# Altium project MC21R01.PrjPCB (part 1 of 3)
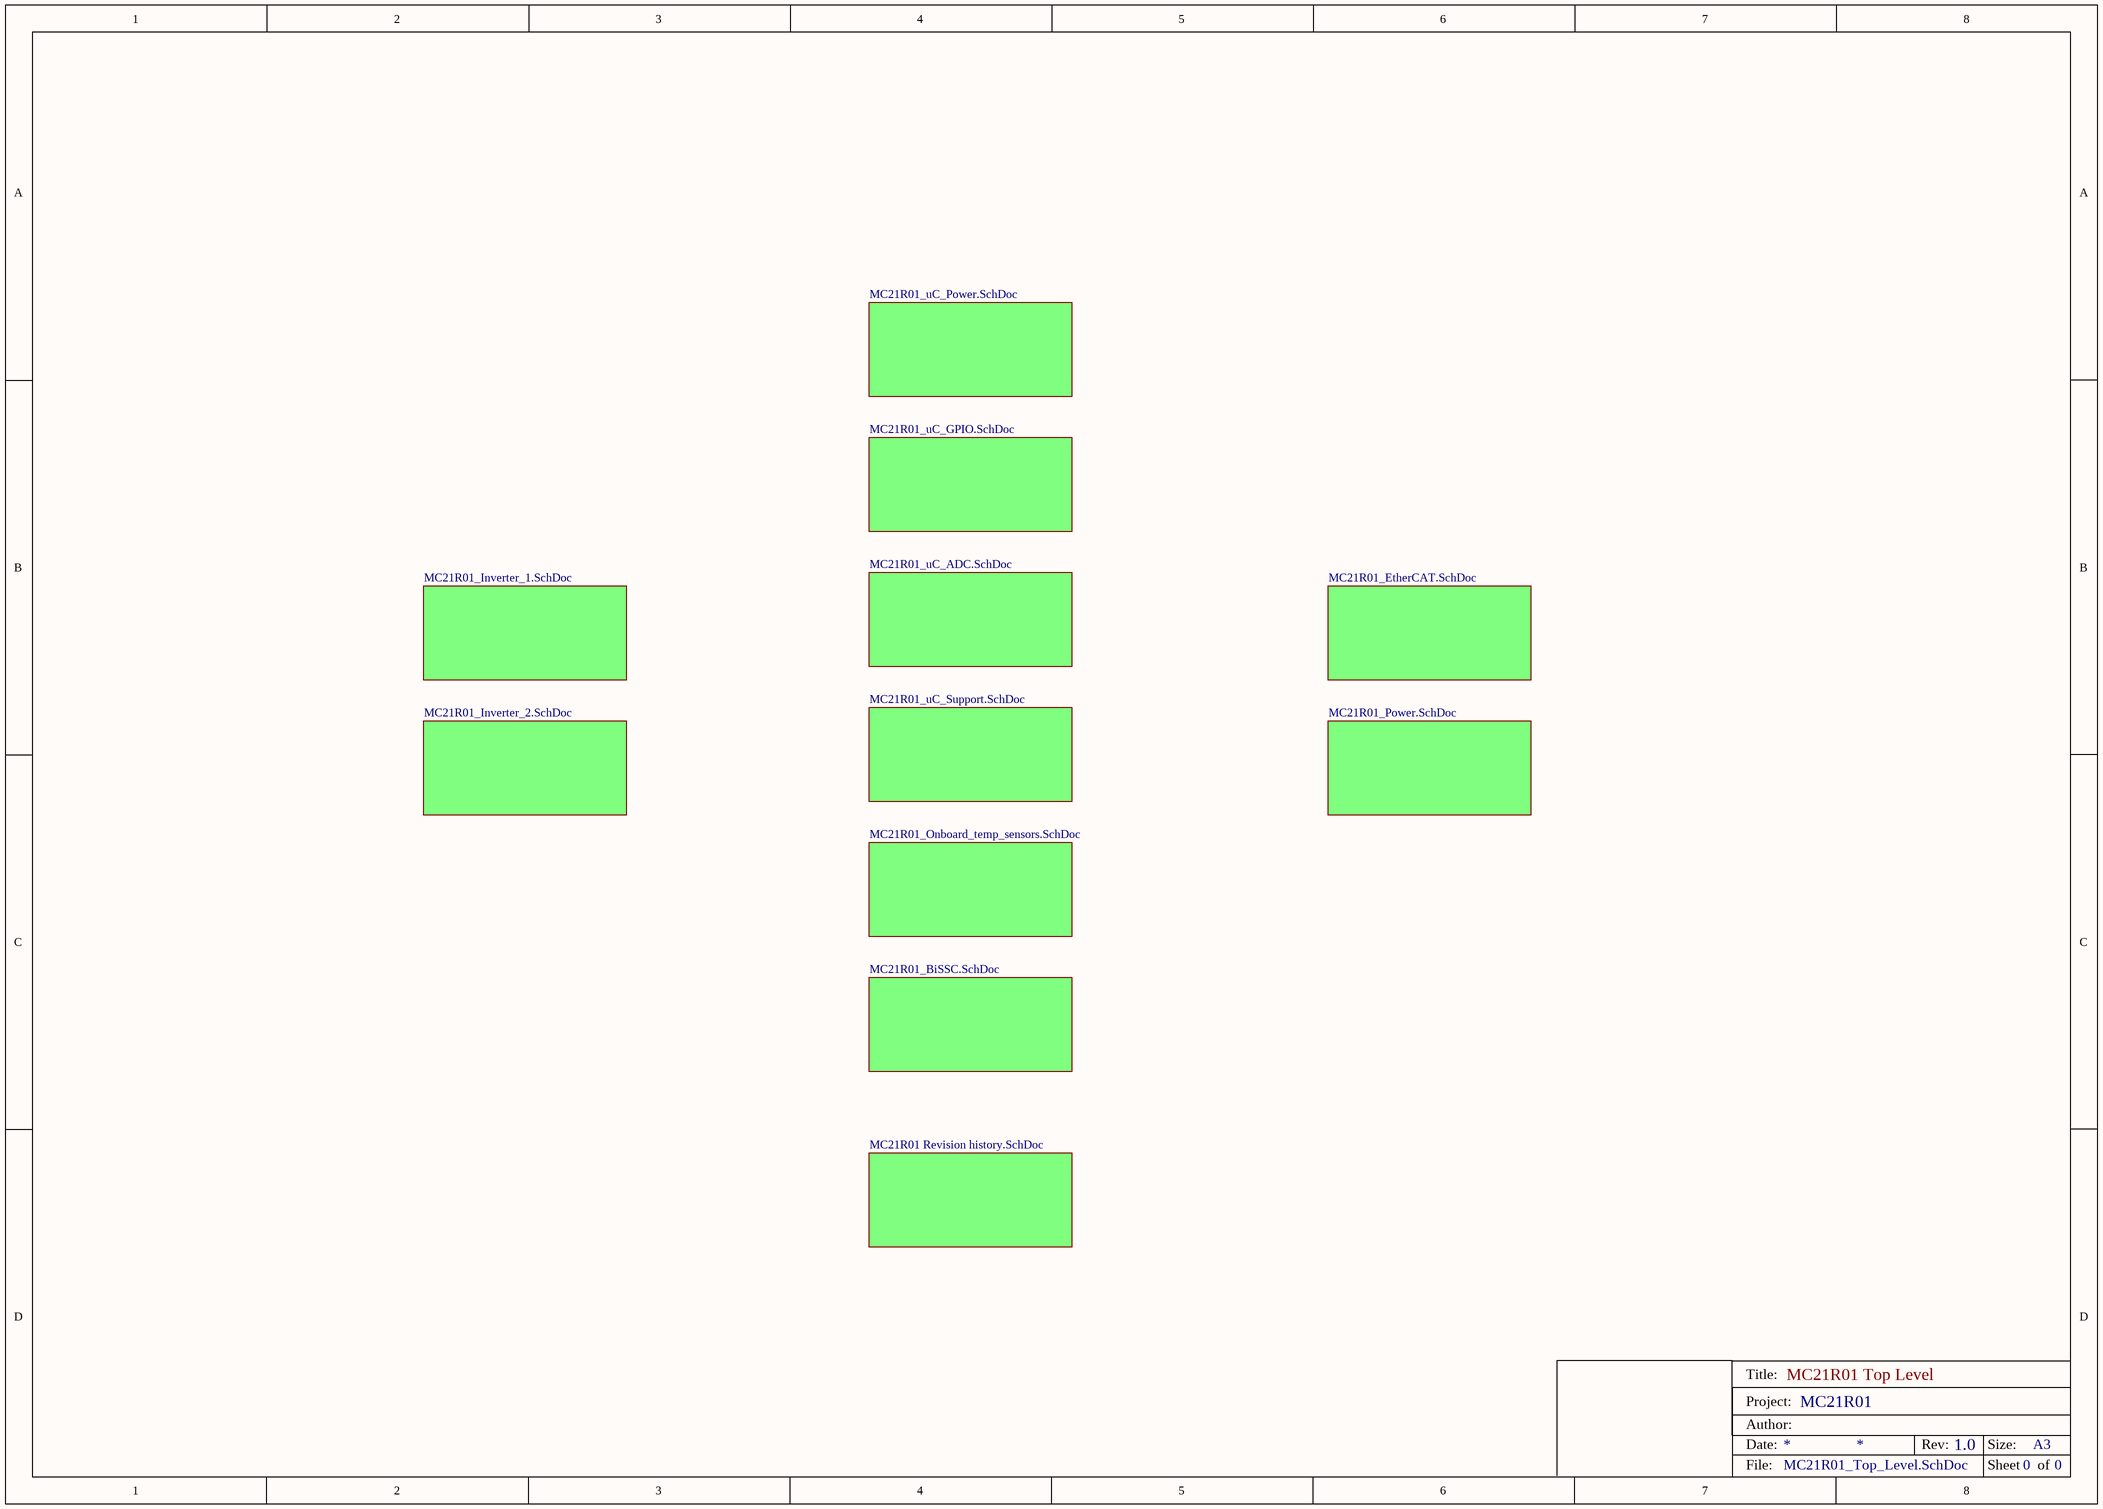
[diagram p0: MC21R01_Top_Level.SchDoc]
Company: PAL Robotics; Projectrevision: 1.00; ProjectTitle: MC21R01
11 sheets, 452 parts. Net scope: global (net labels, ports and power ports of the same name join across sheets).
Board file: MC21R01.PcbDoc
Sheets:
  MC21R01_Top_Level.SchDoc
     = MC21R01_uC_Support.SchDoc
     = MC21R01_uC_Power.SchDoc
     = MC21R01_uC_GPIO.SchDoc
     = MC21R01_Inverter_1.SchDoc
     = MC21R01_Inverter_2.SchDoc
     = MC21R01_Onboard_temp_sensors.SchDoc
     = MC21R01_uC_ADC.SchDoc
     = MC21R01_EtherCAT.SchDoc
     = MC21R01_BiSSC.SchDoc
     = MC21R01_Power.SchDoc

## Sheet MC21R01_Top_Level.SchDoc: MC21R01 Top Level
size A3; Author: AMP; DrawnBy: AMP; Organization: Altium Limited; Address1: 3 Minna Close; Address2: Belrose; Address3: NSW 2085; Address4: Australia; DocumentNumber: 0; Revision: 1.0; SheetNumber: 0; SheetTotal: 0

### Sub-sheets
? = MC21R01 Revision history.SchDoc (file not in this document): no entries
? = MC21R01_uC_Support.SchDoc: no entries
? = MC21R01_uC_Power.SchDoc: no entries
? = MC21R01_uC_GPIO.SchDoc: no entries
? = MC21R01_Inverter_1.SchDoc: no entries
? = MC21R01_Inverter_2.SchDoc: no entries
? = MC21R01_Onboard_temp_sensors.SchDoc: no entries
? = MC21R01_uC_ADC.SchDoc: no entries
? = MC21R01_EtherCAT.SchDoc: no entries
? = MC21R01_BiSSC.SchDoc: no entries
? = MC21R01_Power.SchDoc: no entries

### Notes on the sheet
- Title:
- Date:
- Project:
- Author:
- Rev:
- Size:
- A3
- File:
- Sheet
- of

## Sheet MC21R01_uC_Support.SchDoc: MC21R01 Top Level
size A3; Author: AMP; DrawnBy: AMP; Organization: Altium Limited; Address1: 3 Minna Close; Address2: Belrose; Address3: NSW 2085; Address4: Australia; DocumentNumber: 0; Revision: 1.0; SheetNumber: 0; SheetTotal: 0
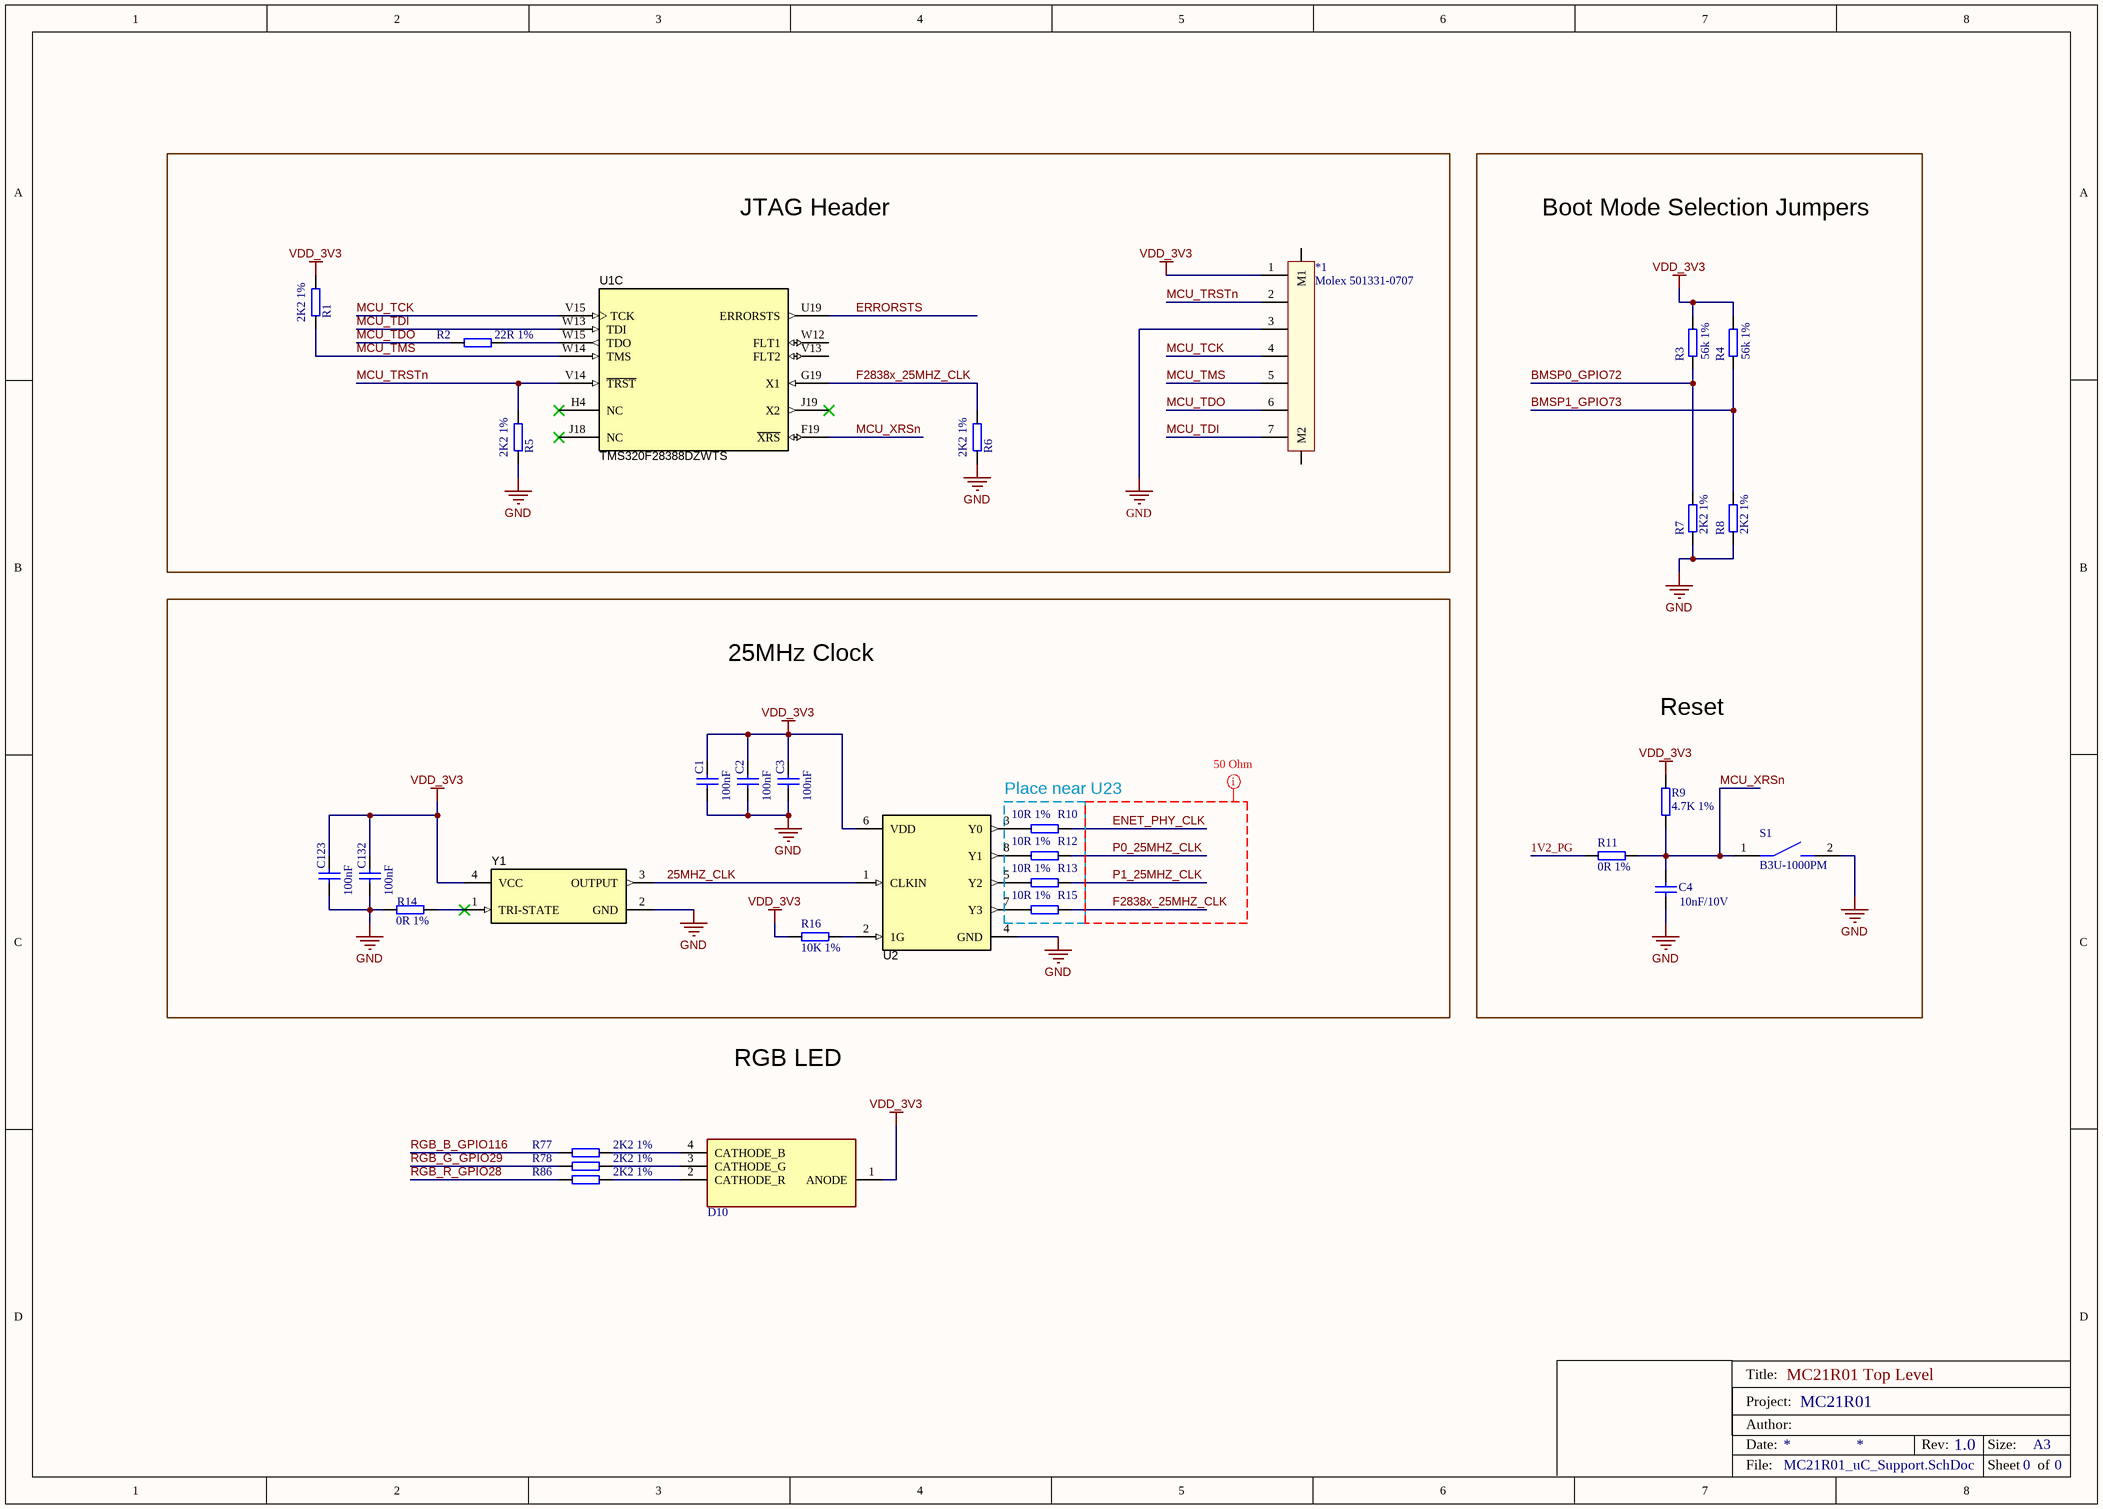
[diagram p1: MC21R01_uC_Support.SchDoc]

### Parts
*1  Molex 501331-0707  [Molex 501331-0707]
C1  value 100nF  [CAPC0603X03N]  (hidden comment: 100nF/25V 0201 10% X6S)
C2  value 100nF  [CAPC0603X03N]  (hidden comment: 100nF/25V 0201 10% X6S)
C3  value 100nF  [CAPC0603X03N]  (hidden comment: 100nF/25V 0201 10% X6S)
C4  value 10nF/10V  [0402 SMD Capacitor]  (hidden comment: 10nF/10V 0402 20% X5R)
C123  value 100nF  [CAPC0603X03N]  (hidden comment: 100nF/25V 0201 10% X6S)
C132  value 100nF  [CAPC0603X03N]  (hidden comment: 100nF/25V 0201 10% X6S)
D10  RGB LED  [LRTB R48G]  (value not drawn)
R1  2K2 1%  [0402 SMD rESISTOR]
R2  22R 1%  [0402 SMD rESISTOR]
R3  56k 1%  [0402 SMD rESISTOR]
R4  56k 1%  [0402 SMD rESISTOR]
R5  2K2 1%  [0402 SMD rESISTOR]
R6  2K2 1%  [0402 SMD rESISTOR]
R7  2K2 1%  [0402 SMD rESISTOR]
R8  2K2 1%  [0402 SMD rESISTOR]
R9  4.7K 1%  [0402 SMD rESISTOR]
R10  10R 1%  [0402 SMD rESISTOR]
R11  0R 1%  [0402 SMD rESISTOR]
R12  10R 1%  [0402 SMD rESISTOR]
R13  10R 1%  [0402 SMD rESISTOR]
R14  0R 1%  [0402 SMD rESISTOR]
R15  10R 1%  [0402 SMD rESISTOR]
R16  10K 1%  [0402 SMD rESISTOR]
R77  2K2 1%  [0402 SMD rESISTOR]
R78  2K2 1%  [0402 SMD rESISTOR]
R86  2K2 1%  [0402 SMD rESISTOR]
S1  B3U-1000PM  [B3U1000PM]
U1  PartNumber: TMS320F28388DZWTS  [ZWT0337A]  (hidden comment: CMP-008-0011-AA01)  (part C of 5)
U2  LMK1C1104PWR  [SOP65P640X120-8N]  (value not drawn)
Y1  ECS-2520S33-250-FN-TR  [ECS_ECS-2520S]  (value not drawn)

### Blocks framed on the sheet
JTAG Header: *1 R1 R2 R5 R6 U1
25MHz Clock: C1-C3 C123 C132 R10 R12-R16 U2 Y1

### Nets
GND: *1.3 C1.1 C2.1 C3.1 C4.2 C123.1 C132.1 R5.1 R6.1 R7.1 R8.1 R14.2 S1.2(NO) U2.4(GND) Y1.2(GND)
VDD_3V3: *1.1 C1.2 C2.2 C3.2 C123.2 C132.2 D10.1(ANODE) R1.2 R3.2 R4.2 R9.2 R16.2 U2.6(VDD) Y1.4(VCC)
1V2_PG: R11.2
25MHZ_CLK: U2.1(CLKIN) Y1.3(OUTPUT)
BMSP0_GPIO72: R3.1 R7.2
BMSP1_GPIO73: R4.1 R8.2
ENET_PHY_CLK: R10.1
ERRORSTS: U1.U19(ERRORSTS)
F2838x_25MHZ_CLK: R6.2 R15.1 U1.G19(X1)
MCU_TCK: *1.4 U1.V15(TCK)
MCU_TDI: *1.7 U1.W13(TDI)
MCU_TDO: *1.6 R2.2
MCU_TMS: *1.5 R1.1 U1.W14(TMS)
MCU_TRSTn: *1.2 R5.2 U1.V14(~{TRST})
MCU_XRSn: C4.1 R9.1 R11.1 S1.1(COM) U1.F19(~{XRS})
P0_25MHZ_CLK: R12.1
P1_25MHZ_CLK: R13.1
RGB_B_GPIO116: R77.2
RGB_G_GPIO29: R78.2
RGB_R_GPIO28: R86.2
NetD10_2: D10.2(CATHODE_R) R86.1
NetD10_3: D10.3(CATHODE_G) R78.1
NetD10_4: D10.4(CATHODE_B) R77.1
NetR2_1: R2.1 U1.W15(TDO)
NetR10_2: R10.2 U2.3(Y0)
NetR12_2: R12.2 U2.8(Y1)
NetR13_2: R13.2 U2.5(Y2)
NetR14_1: R14.1 Y1.1(TRI-STATE)
NetR15_2: R15.2 U2.7(Y3)
NetR16_1: R16.1 U2.2(1G)

Not connected (* = marked no-connect by the designer): *1 M1 M2; U1 H4(NC)* J18(NC)* J19(X2)* V13(FLT2) W12(FLT1)

### Layout directives
50 Ohm Impedance: Undefined: ENET_PHY_CLK, F2838x_25MHZ_CLK, P0_25MHZ_CLK, P1_25MHZ_CLK

### Notes on the sheet
- Boot Mode Selection Jumpers
- Reset
- Place near U23
- RGB LED
- Title:
- Date:
- Project:
- Author:
- Rev:
- Size:
- A3
- File:
- Sheet
- of

### Library data of the parts
*1 = Molex 501331-0707: PicoClasp 07 pin vertical; Supplier 1: Digi-Key; Supplier Part Number 1: WM7884TR-ND
C1-C3 C123 C132 = CMP-001-00061-1: 100nF/25V 0201 10% Tolerance X6S Multilayer Ceramic Chip Capacitor; Populated: Yes; Provided by customer: No; Voltage Rating (DC): 25V; Capacitance: 100nF; Case/Package: 0201; Case Code (Imperial): 0201; Case Code (Metric): 0603; Dielectric: X6S; Height: 0.3mm; Length: 0.024inch; Max Operating Temperature: 105°C; Min Operating Temperature: -55°C; Mount: Surface Mount; Package Quantity: 15000; Packaging: Tape and Reel; Termination: SMD/SMT; Thickness: 0.013inch; Tolerance: 10%; Voltage Rating: 25V; Weight: 1.2E-05oz; Width: 0.3mm
C4 = 10nF/10V 0402 20% X5R: 10nF/10V 0402 20% Tolerance X5R Multilayer Ceramic Chip Capacitor; Manufacturer 1: KEMET; Manufacturer Part Number 1: C0402C103K8PACTU; Supplier Part Number 1: 2773069; Supplier 1: Farnell
D10 = LRTB_R48G: RGB LED, SMD 1x1mm common anode; Manufacturer: OSRAM; Datasheet Link: https://dammedia.osram.info/media/resource/hires/osram-dam-4307982/LRTB%20R48G.pdf; Height: 0.65mm; Manufacturer Part Number: LRTB R48G; Supplier 1: Farnell; Supplier Part Number 1: 2981676; Created by: AMP; Published: 24-08-2020
R1 R5-R8 R77 R78 R86 = 2K2/50V 1% 0402 100mW: 2K2/50V 1% 0402 100mW SMD Resistor; Manufacturer 1: Yageo; Manufacturer Part Number 1: RC0402FR-072K2L; Value: 2.2k; Supplier 1: Farnell; Supplier Part Number 1: 9239278
R2 = 22R/50V 1% 0402 63mW: 22R/50V 1% 0402 63mW SMD Resistor; Manufacturer 1: Vishay; Manufacturer Part Number 1: CRCW040222R0FKED; Supplier 1: Farnell; Supplier Part Number 1: 1469697; Value: 22R
R3 R4 = 56k/50V 1% 0402 100mW: 56k/50V 1% 0402 63mW SMD Resistor; Manufacturer 1: Yageo; Manufacturer Part Number 1: RC0402FR-0756KL; Supplier 1: Farnell; Supplier Part Number 1: 9239448; Value: 56k
R9 = 4.7K/50V 1% 0402 100mW: 4.7K/50V 1% 0402 100mW SMD Resistor; Manufacturer 1: Vishay; Manufacturer Part Number 1: CRCW04024K70FKED; Supplier 1: Farnell; Supplier Part Number 1: 1469712; Value: 4.7K
R10 R12 R13 R15 = 10R/50V 1% 0402 63mW: 10R/50V 1% 0402 63mW SMD Resistor; Manufacturer 1: Yageo; Manufacturer Part Number 1: RC0402FR-0710RL; Supplier 1: Farnell; Supplier Part Number 1: 9238999; Value: 10R
R11 R14 = 0R/50V 1% 0402 100mW: 0R/50V 1% 0402 100mW SMD Resistor; Manufacturer 1: Vishay; Manufacturer Part Number 1: CRCW04020000Z0ED; Supplier 1: Farnell; Supplier Part Number 1: 1469661; Value: 0R
R16 = 10K/50V 1% 0402 100mW: 10K/50V 1% 0402 100mW SMD Resistor; Manufacturer 1: Yageo; Manufacturer Part Number 1: RC0402FR-0710KL; Supplier 1: Farnell; Supplier Part Number 1: 9239359; Value: 10K
S1 = B3U-1000PM: Tactile switch, top actuator; Manufacturer: Omron Electronics; Datasheet Link: https://componentsearchengine.com/Datasheets/1/B3U-1000PM.pdf; Height: 1.75mm; Manufacturer Part Number: B3U-1000PM; Arrow Part Number: B3U-1000PM; Supplier 1: Mouser; Supplier Part Number 1: 653-B3U-1000PM; Mouser Price/Stock: https://www.mouser.co.uk/ProductDetail/Omron-Electronics/B3U-1000PM?qs=hnUcNC2tU0oiJUWqjOlHqA%3D%3D; Created by: AMP; Published: 26-08-2020
U1 = CMP-008-0011-AA01: TMS320F28388DZWTS, ZWT0337A (NFBGA-337); Manufacturer: Texas Instruments; SizeAreaWB_mm2: 324; SizeArea_mm2: 256; AEC Qualified: N; AEC Category: Q200; SizeZ_mm: 1.4; SizeY_mm: 16; CompType: IC; ComponentLink1Description: Datasheet Link; ComponentLink2Description: Product Folder; PackageReference: ZWT0337A; PackageDescription: NFBGA-337; ComponentLink2URL: http://www.ti.com/product/tms320f28388d; Alternate Manufacturer: Texas Instruments; ComponentLink3URL: http://www.ti.com/product/tms320f28388d/datasheet; ComponentLink1URL: http://www.ti.com/lit/ds/symlink/tms320f28388d.pdf; MountType: SMT; ComponentLink3Description: Online Datasheet; SizeX_mm: 16; Design Item ID: TMS320F28388; Source: MC21R01.SCHLIB; Pin Count: 337; Component Type: Standard
U2 = LMK1C1104PWR: Low Jitter, 1:4 LVCMOS Fan-out Clock Buffer, PW0008A (TSSOP-8); Alternate Manufacturer: Texas Instruments; Green_Lifecycle: Active; SizeAreaWB_mm2: 42.0; Green_REACh: Passed; U/M: EA; SizeZ_mm: 1.2; SizeX_mm: 6.4; SizeY_mm: 3.0; SizeArea_mm2: 19.2; CompType: IC; ComponentLink1URL: http://www.ti.com/lit/ds/symlink/cdclvc1104.pdf; Publisher: Texas Instruments; PackageDescription: TSSOP-8; RoHS: Y; MountType: SMT; Green_EU RoHS-2: Passed; Manufacturer: Texas Instruments; Green_EU RoHS: Passed; PackageReference: PW0008A; PartNumber: LMK1C1104PWR; ComponentLink1Description: Datasheet Link; Supplier 1: Mouser; Supplier Part Number 1: 595-LMK1C1104PWR
Y1 = CMP-0082061-1: Oscillator, 25 MHz, 15 pF, SMD; Manufacturer: ECS Inc.; Frequency Stability: 10 ppm; SizeAreaWB_mm2: 10.5; SizeArea_mm2: 5; AEC Qualified: N; AEC Category: Q200; TaMax_C: 85°C; SizeZ_mm: 1; Frequency_Fixed: 25MHz; TaMin_C: -40°C; SizeY_mm: 2.5; Load Capacitance: 15 pF; SizeX_mm: 2; ComponentLink1Description: Datasheet Link; RoHS: Y; Supplier 1: Digi-Key; PackageReference: 2x2.5mm; PartNumber: ECS-2520S33-250-FN-TR; Supplier Part Number 2: 520-2520S33-250-FNT; Supplier 2: Mouser; AEC Grade: N/A; ComponentLink1URL: https://www.ecsxtal.com/store/pdf/ECS-2520S.pdf; CompType: Oscillator; Supplier Part Number 1: XC2198CT-ND; MountType: SMT

## Sheet MC21R01_uC_Power.SchDoc: MC21R01 Top Level
size A3; Author: AMP; DrawnBy: AMP; Organization: Altium Limited; Address1: 3 Minna Close; Address2: Belrose; Address3: NSW 2085; Address4: Australia; DocumentNumber: 0; Revision: 1.0; SheetNumber: 0; SheetTotal: 0
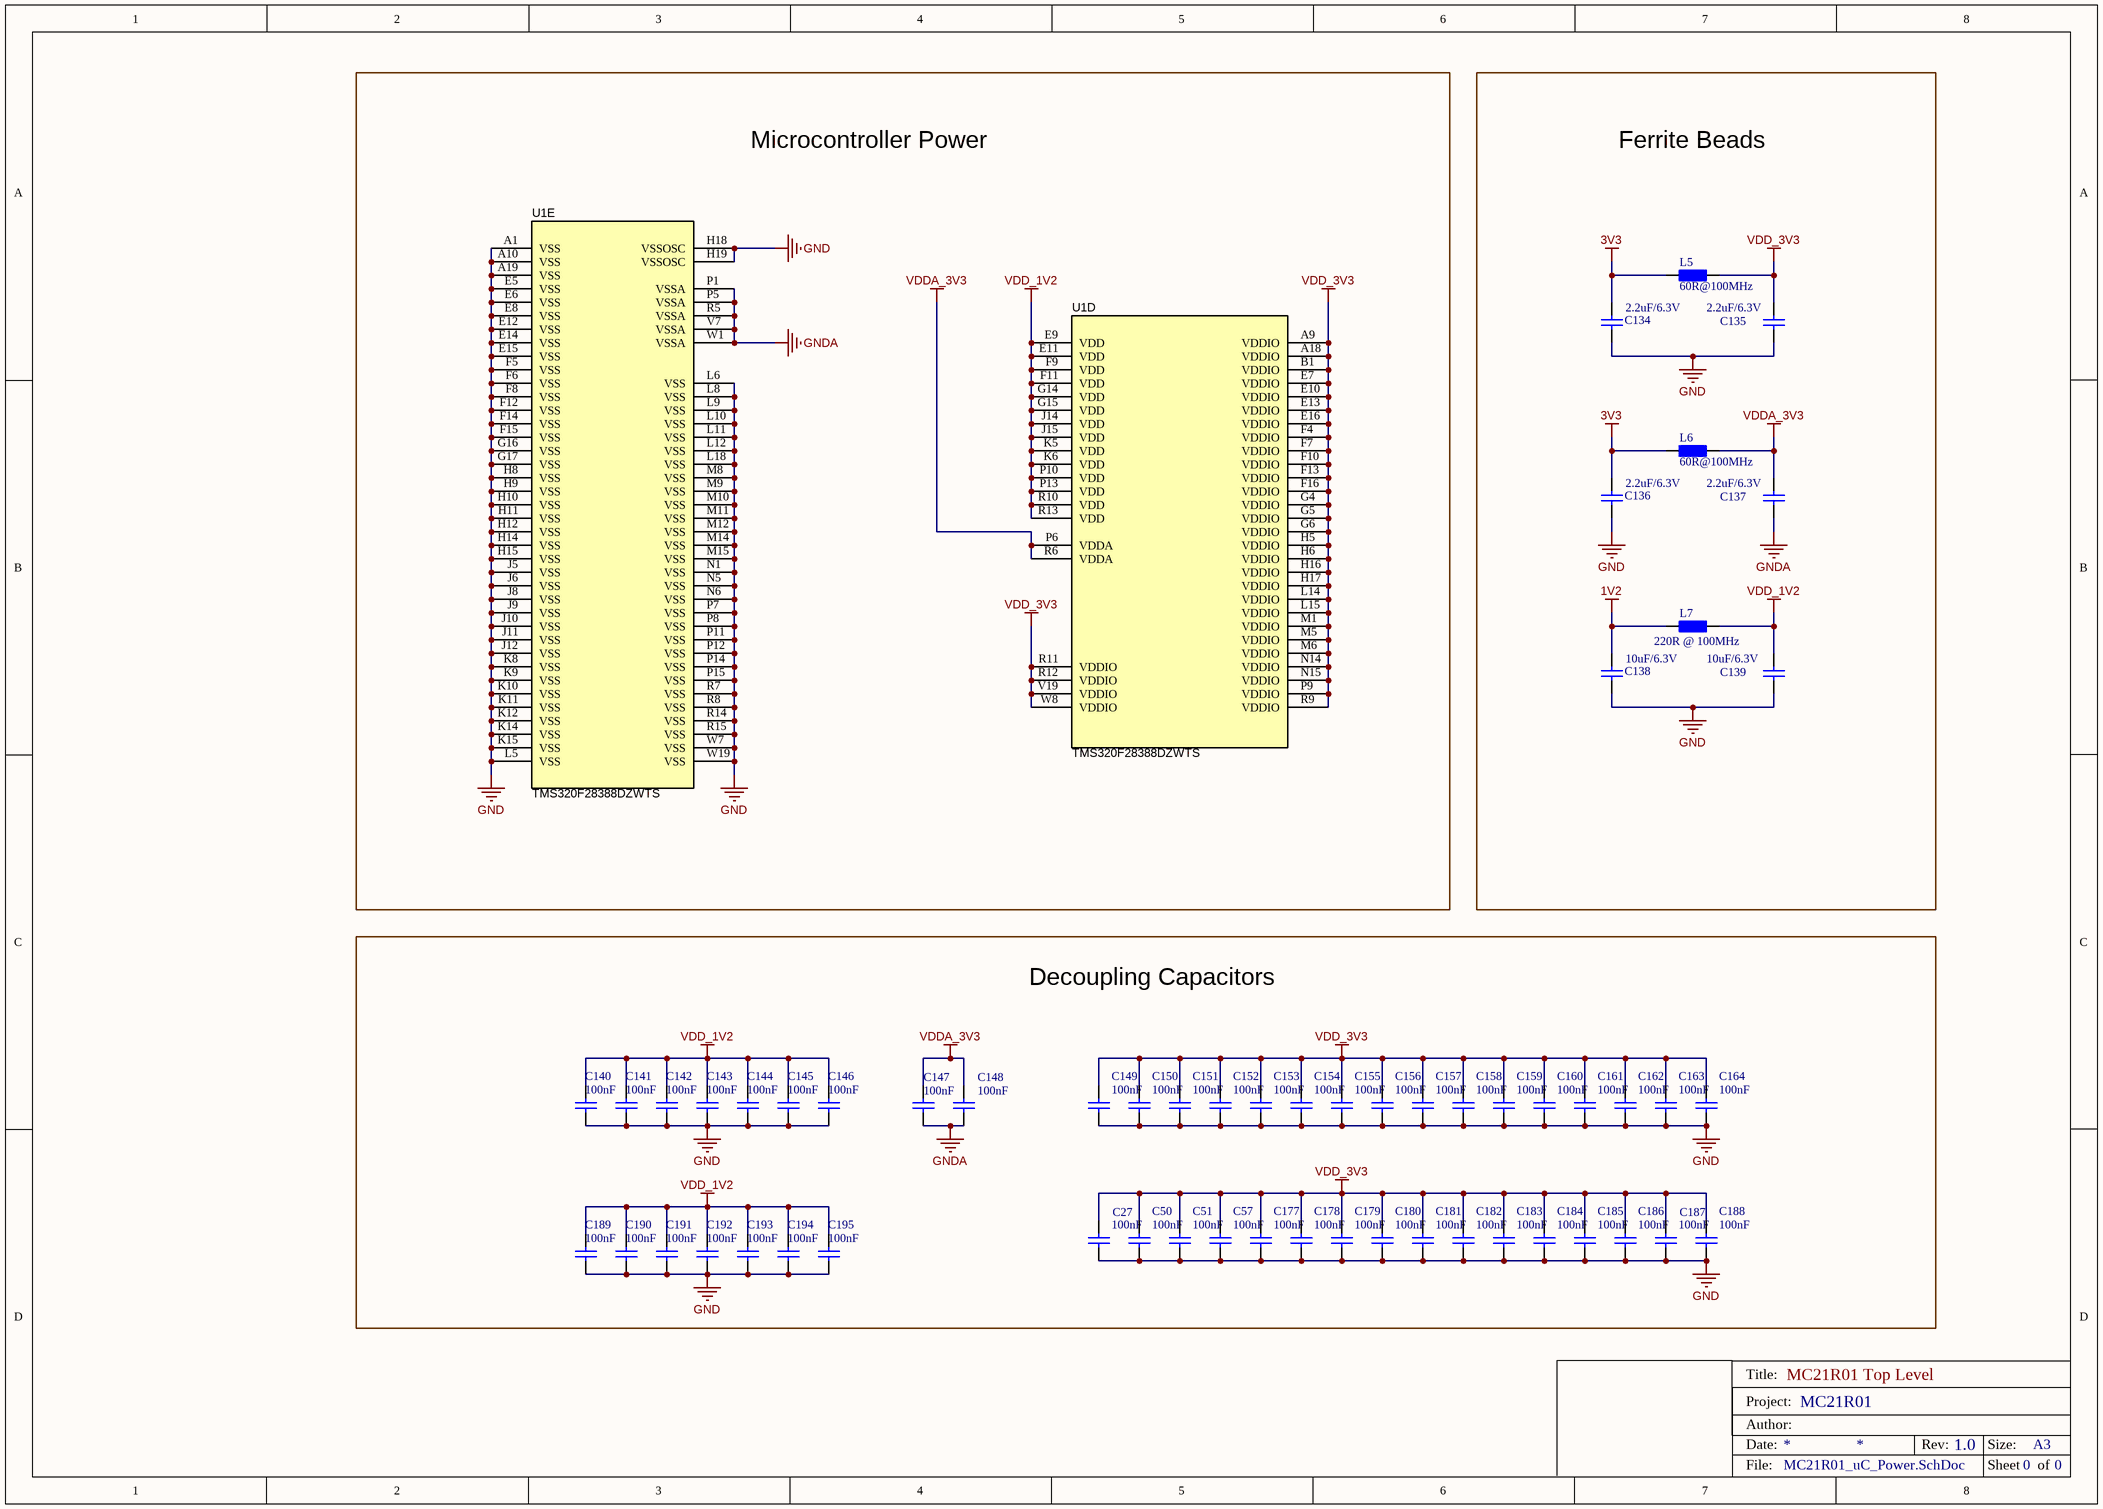
[diagram p2: MC21R01_uC_Power.SchDoc]

### Parts
C27  value 100nF  [CAPC0603X03N]  (hidden comment: 100nF/25V 0201 10% X6S)
C50  value 100nF  [CAPC0603X03N]  (hidden comment: 100nF/25V 0201 10% X6S)
C51  value 100nF  [CAPC0603X03N]  (hidden comment: 100nF/25V 0201 10% X6S)
C57  value 100nF  [CAPC0603X03N]  (hidden comment: 100nF/25V 0201 10% X6S)
C134  value 2.2uF/6.3V  [0402 SMD Capacitor]  (hidden comment: 2.2uF/6.3V 0402 10% X5R)
C135  value 2.2uF/6.3V  [0402 SMD Capacitor]  (hidden comment: 2.2uF/6.3V 0402 10% X5R)
C136  value 2.2uF/6.3V  [0402 SMD Capacitor]  (hidden comment: 2.2uF/6.3V 0402 10% X5R)
C137  value 2.2uF/6.3V  [0402 SMD Capacitor]  (hidden comment: 2.2uF/6.3V 0402 10% X5R)
C138  value 10uF/6.3V  [0402 SMD Capacitor]  (hidden comment: 10uF/6.3V 0402 20% X5R)
C139  value 10uF/6.3V  [0402 SMD Capacitor]  (hidden comment: 10uF/6.3V 0402 20% X5R)
C140  value 100nF  [CAPC0603X03N]  (hidden comment: 100nF/25V 0201 10% X6S)
C141  value 100nF  [CAPC0603X03N]  (hidden comment: 100nF/25V 0201 10% X6S)
C142  value 100nF  [CAPC0603X03N]  (hidden comment: 100nF/25V 0201 10% X6S)
C143  value 100nF  [CAPC0603X03N]  (hidden comment: 100nF/25V 0201 10% X6S)
C144  value 100nF  [CAPC0603X03N]  (hidden comment: 100nF/25V 0201 10% X6S)
C145  value 100nF  [CAPC0603X03N]  (hidden comment: 100nF/25V 0201 10% X6S)
C146  value 100nF  [CAPC0603X03N]  (hidden comment: 100nF/25V 0201 10% X6S)
C147  value 100nF  [CAPC0603X03N]  (hidden comment: 100nF/25V 0201 10% X6S)
C148  value 100nF  [CAPC0603X03N]  (hidden comment: 100nF/25V 0201 10% X6S)
C149  value 100nF  [CAPC0603X03N]  (hidden comment: 100nF/25V 0201 10% X6S)
C150  value 100nF  [CAPC0603X03N]  (hidden comment: 100nF/25V 0201 10% X6S)
C151  value 100nF  [CAPC0603X03N]  (hidden comment: 100nF/25V 0201 10% X6S)
C152  value 100nF  [CAPC0603X03N]  (hidden comment: 100nF/25V 0201 10% X6S)
C153  value 100nF  [CAPC0603X03N]  (hidden comment: 100nF/25V 0201 10% X6S)
C154  value 100nF  [CAPC0603X03N]  (hidden comment: 100nF/25V 0201 10% X6S)
C155  value 100nF  [CAPC0603X03N]  (hidden comment: 100nF/25V 0201 10% X6S)
C156  value 100nF  [CAPC0603X03N]  (hidden comment: 100nF/25V 0201 10% X6S)
C157  value 100nF  [CAPC0603X03N]  (hidden comment: 100nF/25V 0201 10% X6S)
C158  value 100nF  [CAPC0603X03N]  (hidden comment: 100nF/25V 0201 10% X6S)
C159  value 100nF  [CAPC0603X03N]  (hidden comment: 100nF/25V 0201 10% X6S)
C160  value 100nF  [CAPC0603X03N]  (hidden comment: 100nF/25V 0201 10% X6S)
C161  value 100nF  [CAPC0603X03N]  (hidden comment: 100nF/25V 0201 10% X6S)
C162  value 100nF  [CAPC0603X03N]  (hidden comment: 100nF/25V 0201 10% X6S)
C163  value 100nF  [CAPC0603X03N]  (hidden comment: 100nF/25V 0201 10% X6S)
C164  value 100nF  [CAPC0603X03N]  (hidden comment: 100nF/25V 0201 10% X6S)
C177  value 100nF  [CAPC0603X03N]  (hidden comment: 100nF/25V 0201 10% X6S)
C178  value 100nF  [CAPC0603X03N]  (hidden comment: 100nF/25V 0201 10% X6S)
C179  value 100nF  [CAPC0603X03N]  (hidden comment: 100nF/25V 0201 10% X6S)
C180  value 100nF  [CAPC0603X03N]  (hidden comment: 100nF/25V 0201 10% X6S)
C181  value 100nF  [CAPC0603X03N]  (hidden comment: 100nF/25V 0201 10% X6S)
C182  value 100nF  [CAPC0603X03N]  (hidden comment: 100nF/25V 0201 10% X6S)
C183  value 100nF  [CAPC0603X03N]  (hidden comment: 100nF/25V 0201 10% X6S)
C184  value 100nF  [CAPC0603X03N]  (hidden comment: 100nF/25V 0201 10% X6S)
C185  value 100nF  [CAPC0603X03N]  (hidden comment: 100nF/25V 0201 10% X6S)
C186  value 100nF  [CAPC0603X03N]  (hidden comment: 100nF/25V 0201 10% X6S)
C187  value 100nF  [CAPC0603X03N]  (hidden comment: 100nF/25V 0201 10% X6S)
C188  value 100nF  [CAPC0603X03N]  (hidden comment: 100nF/25V 0201 10% X6S)
C189  value 100nF  [CAPC0603X03N]  (hidden comment: 100nF/25V 0201 10% X6S)
C190  value 100nF  [CAPC0603X03N]  (hidden comment: 100nF/25V 0201 10% X6S)
C191  value 100nF  [CAPC0603X03N]  (hidden comment: 100nF/25V 0201 10% X6S)
C192  value 100nF  [CAPC0603X03N]  (hidden comment: 100nF/25V 0201 10% X6S)
C193  value 100nF  [CAPC0603X03N]  (hidden comment: 100nF/25V 0201 10% X6S)
C194  value 100nF  [CAPC0603X03N]  (hidden comment: 100nF/25V 0201 10% X6S)
C195  value 100nF  [CAPC0603X03N]  (hidden comment: 100nF/25V 0201 10% X6S)
L5  60R@100MHz  [0603 SMD inductor]
L6  60R@100MHz  [0603 SMD inductor]
L7  220R @ 100MHz  [0603 SMD inductor]
U1  TMS320F28388DZWTS  [ZWT0337A]  (parts D,E of 5)

### Blocks framed on the sheet
Microcontroller Power: U1
Ferrite Beads: C134-C139 L5-L7
Decoupling Capacitors: C27 C50 C51 C57 C140-C164 C177-C195

### Nets
1V2: C138.1 L7.2
3V3: C134.1 C136.1 L5.2 L6.2
GND: C27.1 C50.1 C51.1 C57.1 C134.2 C135.2 C136.2 C138.2 C139.2 C140.1 C141.1 C142.1 C143.1 C144.1 C145.1 C146.1 C149.1 C150.1 C151.1 C152.1 C153.1 C154.1 C155.1 C156.1 C157.1 C158.1 C159.1 C160.1 C161.1 C162.1 C163.1 C164.1 C177.1 C178.1 C179.1 C180.1 C181.1 C182.1 C183.1 C184.1 C185.1 C186.1 C187.1 C188.1 C189.1 C190.1 C191.1 C192.1 C193.1 C194.1 C195.1 U1.A1(VSS) U1.A10(VSS) U1.A19(VSS) U1.E5(VSS) U1.E6(VSS) U1.E8(VSS) U1.E12(VSS) U1.E14(VSS) U1.E15(VSS) U1.F5(VSS) U1.F6(VSS) U1.F8(VSS) U1.F12(VSS) U1.F14(VSS) U1.F15(VSS) U1.G16(VSS) U1.G17(VSS) U1.H8(VSS) U1.H9(VSS) U1.H10(VSS) U1.H11(VSS) U1.H12(VSS) U1.H14(VSS) U1.H15(VSS) U1.H18(VSSOSC) U1.H19(VSSOSC) U1.J5(VSS) U1.J6(VSS) U1.J8(VSS) U1.J9(VSS) U1.J10(VSS) U1.J11(VSS) U1.J12(VSS) U1.K8(VSS) U1.K9(VSS) U1.K10(VSS) U1.K11(VSS) U1.K12(VSS) U1.K14(VSS) U1.K15(VSS) U1.L5(VSS) U1.L6(VSS) U1.L8(VSS) U1.L9(VSS) U1.L10(VSS) U1.L11(VSS) U1.L12(VSS) U1.L18(VSS) U1.M8(VSS) U1.M9(VSS) U1.M10(VSS) U1.M11(VSS) U1.M12(VSS) U1.M14(VSS) U1.M15(VSS) U1.N1(VSS) U1.N5(VSS) U1.N6(VSS) U1.P7(VSS) U1.P8(VSS) U1.P11(VSS) U1.P12(VSS) U1.P14(VSS) U1.P15(VSS) U1.R7(VSS) U1.R8(VSS) U1.R14(VSS) U1.R15(VSS) U1.W7(VSS) U1.W19(VSS)
GNDA: C137.2 C147.1 C148.1 U1.P1(VSSA) U1.P5(VSSA) U1.R5(VSSA) U1.V7(VSSA) U1.W1(VSSA)
VDD_1V2: C139.1 C140.2 C141.2 C142.2 C143.2 C144.2 C145.2 C146.2 C189.2 C190.2 C191.2 C192.2 C193.2 C194.2 C195.2 L7.1 U1.E9(VDD) U1.E11(VDD) U1.F9(VDD) U1.F11(VDD) U1.G14(VDD) U1.G15(VDD) U1.J14(VDD) U1.J15(VDD) U1.K5(VDD) U1.K6(VDD) U1.P10(VDD) U1.P13(VDD) U1.R10(VDD) U1.R13(VDD)
VDD_3V3: C27.2 C50.2 C51.2 C57.2 C135.1 C149.2 C150.2 C151.2 C152.2 C153.2 C154.2 C155.2 C156.2 C157.2 C158.2 C159.2 C160.2 C161.2 C162.2 C163.2 C164.2 C177.2 C178.2 C179.2 C180.2 C181.2 C182.2 C183.2 C184.2 C185.2 C186.2 C187.2 C188.2 L5.1 U1.A9(VDDIO) U1.A18(VDDIO) U1.B1(VDDIO) U1.E7(VDDIO) U1.E10(VDDIO) U1.E13(VDDIO) U1.E16(VDDIO) U1.F4(VDDIO) U1.F7(VDDIO) U1.F10(VDDIO) U1.F13(VDDIO) U1.F16(VDDIO) U1.G4(VDDIO) U1.G5(VDDIO) U1.G6(VDDIO) U1.H5(VDDIO) U1.H6(VDDIO) U1.H16(VDDIO) U1.H17(VDDIO) U1.L14(VDDIO) U1.L15(VDDIO) U1.M1(VDDIO) U1.M5(VDDIO) U1.M6(VDDIO) U1.N14(VDDIO) U1.N15(VDDIO) U1.P9(VDDIO) U1.R9(VDDIO) U1.R11(VDDIO) U1.R12(VDDIO) U1.V19(VDDIO) U1.W8(VDDIO)
VDDA_3V3: C137.1 C147.2 C148.2 L6.1 U1.P6(VDDA) U1.R6(VDDA)

### Notes on the sheet
- Title:
- Date:
- Project:
- Author:
- Rev:
- Size:
- A3
- File:
- Sheet
- of

### Library data of the parts
C27 C50 C51 C57 C140-C164 C177-C195 = CMP-001-00061-1: as C1 on sheet MC21R01_uC_Support; Capacitance: 100nF; Case/Package: 0201; Case Code (Imperial): 0201; Case Code (Metric): 0603; Dielectric: X6S; Height: 0.3mm; Length: 0.024inch; Max Operating Temperature: 105°C; Min Operating Temperature: -55°C; Mount: Surface Mount; Package Quantity: 15000; Packaging: Tape and Reel; Termination: SMD/SMT; Thickness: 0.013inch; Tolerance: 10%; Voltage Rating: 25V; Weight: 1.2E-05oz; Width: 0.3mm
C134-C137 = 2.2uF/6.3V 0402 10% X5R_1: 2.2uF/6.3V 0402 10% Tolerance X5R Multilayer Ceramic Chip Capacitor; Manufacturer 1: KEMET; Manufacturer Part Number 1: C0402C225K9PACTU; Supplier Part Number 1: 2442787; Supplier 1: Farnell
C138 C139 = 10uF/6.3V 0402 20% X5R: 10uF/6.3V 0402 20% Tolerance X5R Multilayer Ceramic Chip Capacitor; Manufacturer 1: KEMET; Manufacturer Part Number 1: C0402C106M9PACTU; Supplier Part Number 1: 2507061; Supplier 1: Farnell
L5 L6 = FB, 60 ohm, 0603 [1608 Metric], 3 A, 0.04 ohm, ± 25%: Ferrite Bead, 60 ohm, 0603 [1608 Metric], 3 A, 0.04 ohm, ± 25%; MPN: 742792602; MF: Wurth Electronik; DC Current Rating: 3A; DC Resistance Max:: 0.04R; Tolerance: ±25%; Impedance: 60R@100MHz; Supplier 1: Farnell; Supplier Part Number 1: 1635704
L7 = FB, 220 ohm, 0603 [1608 Metric], 2 A, 0.05 ohm, ± 25%: Ferrite Bead, 220 ohm, 0603 [1608 Metric], 2 A, 0.05 ohm, ± 25%; MPN: BLM18EG221SN1D; MF: MURATA; DC Current Rating: 2A; DC Resistance Max:: 0R05; Tolerance: ±25%; Impedance: 220R @ 100MHz; Supplier 1: Farnell; Supplier Part Number 1: 1515716
U1 = TMS320F28388: TMS320F28388DZWTS, ZWT0337A (NFBGA-337); Manufacturer: Texas Instruments; SizeAreaWB_mm2: 324; SizeArea_mm2: 256; AEC Qualified: N; AEC Category: Q200; SizeZ_mm: 1.4; SizeY_mm: 16; CompType: IC; ComponentLink1Description: Datasheet Link; ComponentLink2Description: Product Folder; PackageReference: ZWT0337A; PackageDescription: NFBGA-337; ComponentLink2URL: http://www.ti.com/product/tms320f28388d; Alternate Manufacturer: Texas Instruments; ComponentLink3URL: http://www.ti.com/product/tms320f28388d/datasheet; ComponentLink1URL: http://www.ti.com/lit/ds/symlink/tms320f28388d.pdf; MountType: SMT; ComponentLink3Description: Online Datasheet; SizeX_mm: 16; PartNumber: TMS320F28388DZWTS

## Sheet MC21R01_uC_GPIO.SchDoc: MC21R01 Top Level
size A3; Author: AMP; DrawnBy: AMP; Organization: Altium Limited; Address1: 3 Minna Close; Address2: Belrose; Address3: NSW 2085; Address4: Australia; DocumentNumber: 0; Revision: 1.0; SheetNumber: 0; SheetTotal: 0
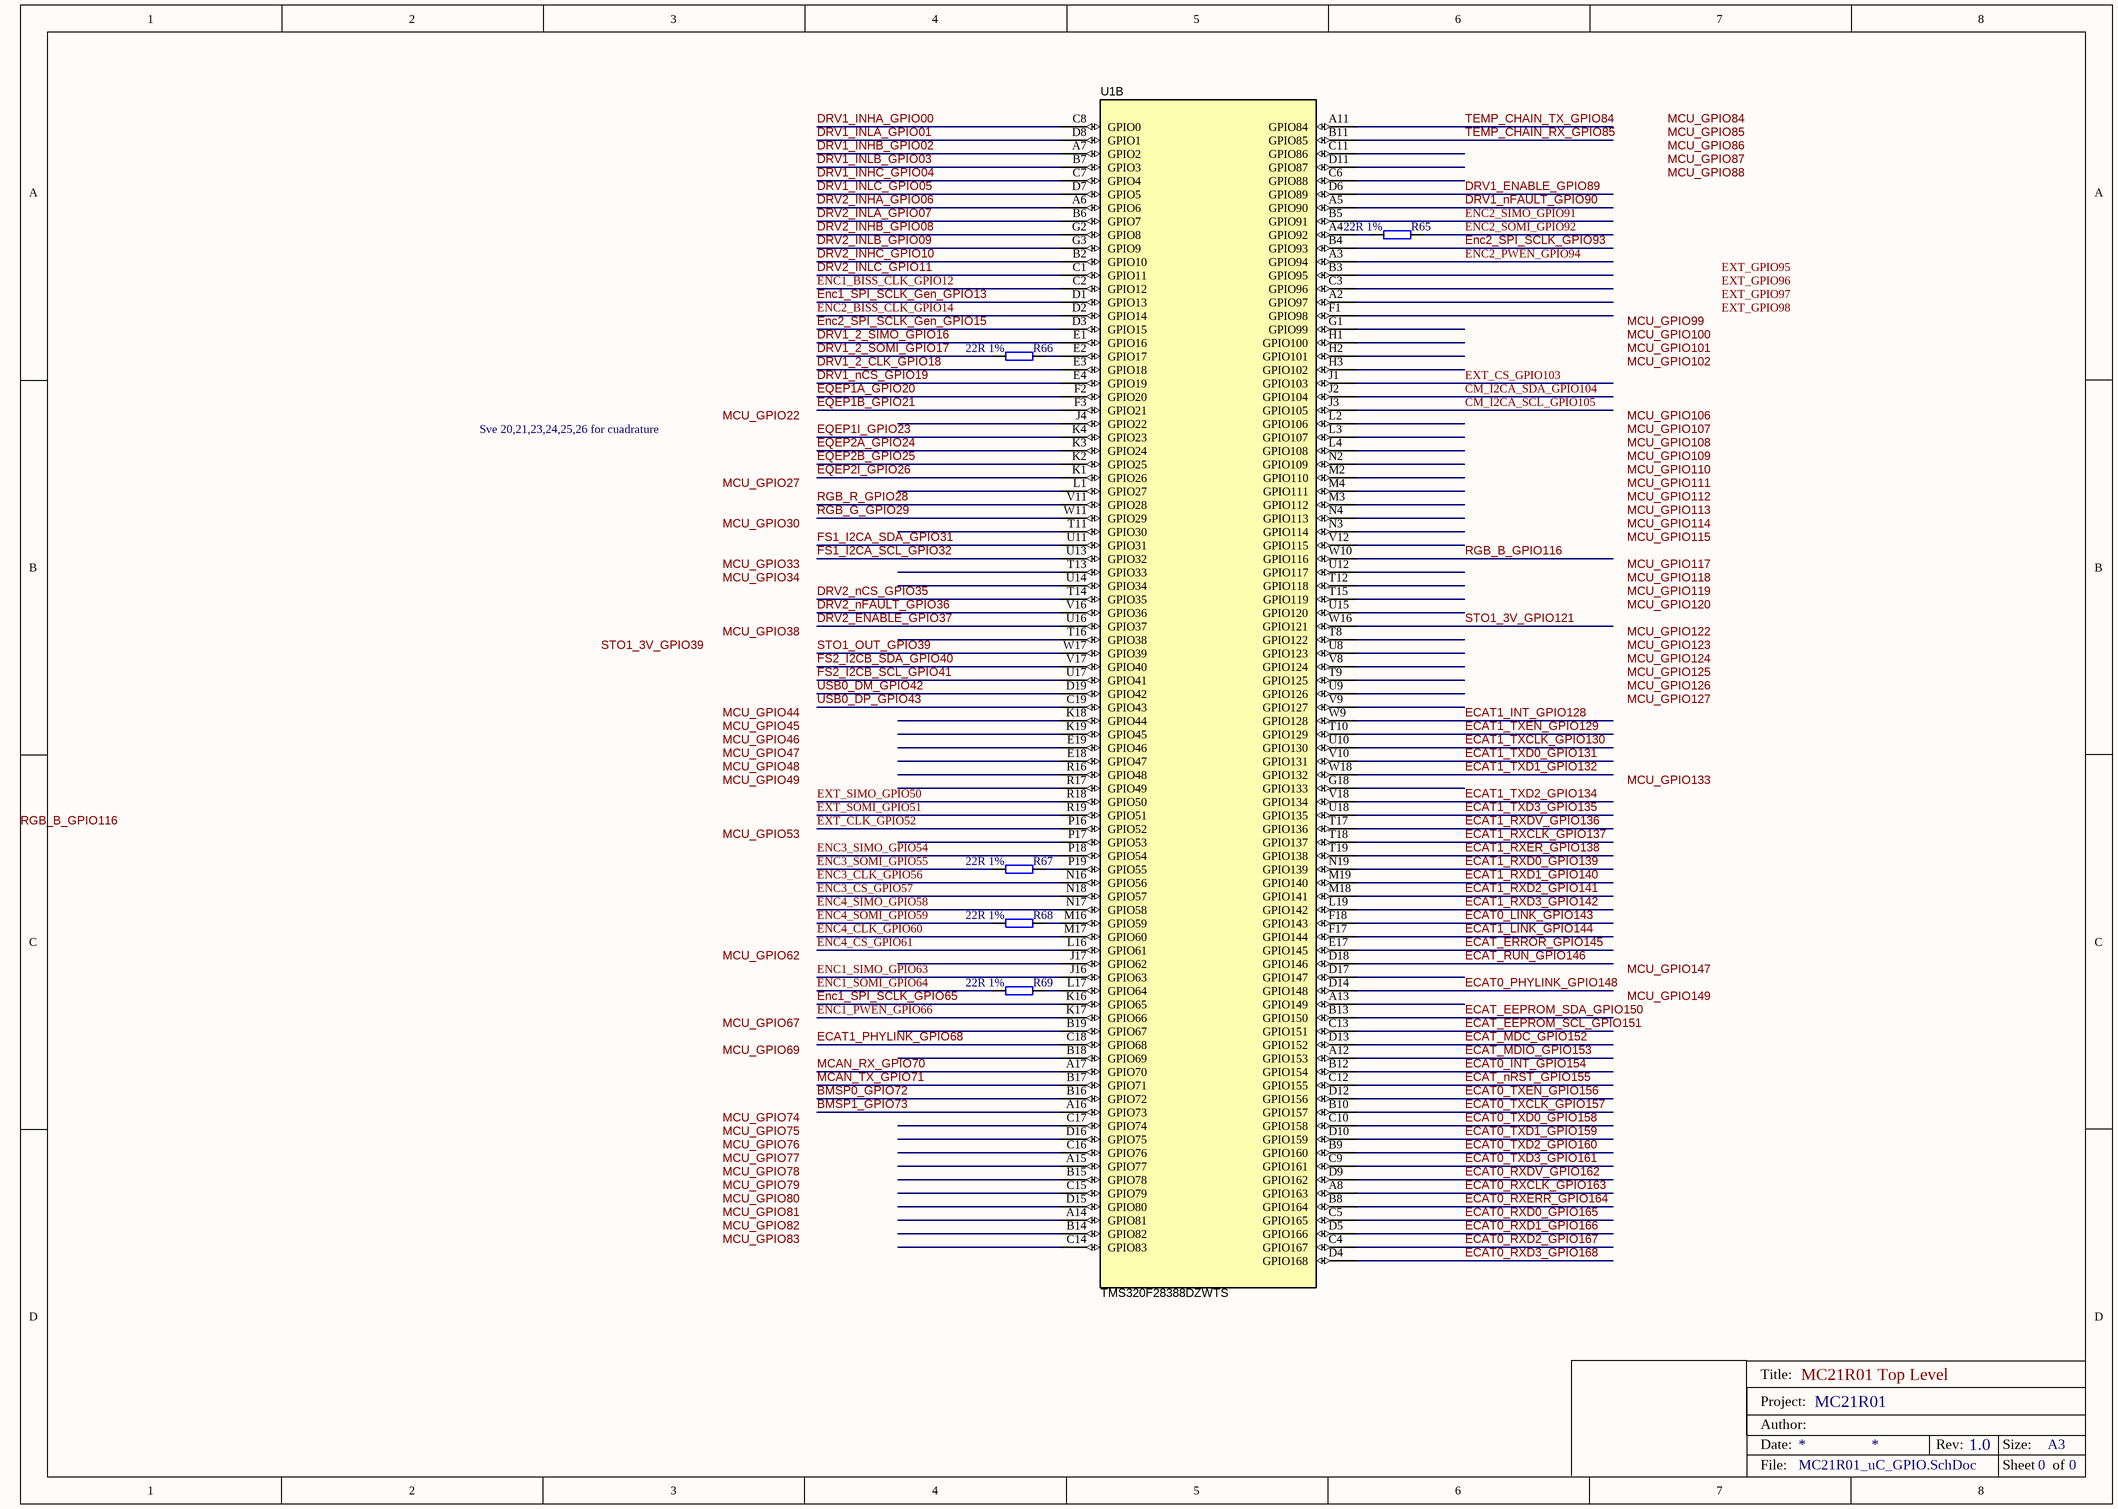
[diagram p3: MC21R01_uC_GPIO.SchDoc]

### Parts
R65  22R 1%  [0402 SMD rESISTOR]
R66  22R 1%  [0402 SMD rESISTOR]
R67  22R 1%  [0402 SMD rESISTOR]
R68  22R 1%  [0402 SMD rESISTOR]
R69  22R 1%  [0402 SMD rESISTOR]
U1  TMS320F28388DZWTS  [ZWT0337A]  (part B of 5)

### Nets
BMSP0_GPIO72: U1.B16(GPIO72)
BMSP1_GPIO73: U1.A16(GPIO73)
CM_I2CA_SCL_GPIO105: U1.J3(GPIO105)
CM_I2CA_SDA_GPIO104: U1.J2(GPIO104)
DRV1_2_CLK_GPIO18: U1.E3(GPIO18)
DRV1_2_SIMO_GPIO16: U1.E1(GPIO16)
DRV1_2_SOMI_GPIO17: R66.2
DRV1_ENABLE_GPIO89: U1.D6(GPIO89)
DRV1_INHA_GPIO00: U1.C8(GPIO0)
DRV1_INHB_GPIO02: U1.A7(GPIO2)
DRV1_INHC_GPIO04: U1.C7(GPIO4)
DRV1_INLA_GPIO01: U1.D8(GPIO1)
DRV1_INLB_GPIO03: U1.B7(GPIO3)
DRV1_INLC_GPIO05: U1.D7(GPIO5)
DRV1_nCS_GPIO19: U1.E4(GPIO19)
DRV1_nFAULT_GPIO90: U1.A5(GPIO90)
DRV2_ENABLE_GPIO37: U1.U16(GPIO37)
DRV2_INHA_GPIO06: U1.A6(GPIO6)
DRV2_INHB_GPIO08: U1.G2(GPIO8)
DRV2_INHC_GPIO10: U1.B2(GPIO10)
DRV2_INLA_GPIO07: U1.B6(GPIO7)
DRV2_INLB_GPIO09: U1.G3(GPIO9)
DRV2_INLC_GPIO11: U1.C1(GPIO11)
DRV2_nCS_GPIO35: U1.T14(GPIO35)
DRV2_nFAULT_GPIO36: U1.V16(GPIO36)
ECAT0_INT_GPIO154: U1.B12(GPIO154)
ECAT0_LINK_GPIO143: U1.F18(GPIO143)
ECAT0_PHYLINK_GPIO148: U1.D14(GPIO148)
ECAT0_RXCLK_GPIO163: U1.A8(GPIO163)
ECAT0_RXD0_GPIO165: U1.C5(GPIO165)
ECAT0_RXD1_GPIO166: U1.D5(GPIO166)
ECAT0_RXD2_GPIO167: U1.C4(GPIO167)
ECAT0_RXD3_GPIO168: U1.D4(GPIO168)
ECAT0_RXDV_GPIO162: U1.D9(GPIO162)
ECAT0_RXERR_GPIO164: U1.B8(GPIO164)
ECAT0_TXCLK_GPIO157: U1.B10(GPIO157)
ECAT0_TXD0_GPIO158: U1.C10(GPIO158)
ECAT0_TXD1_GPIO159: U1.D10(GPIO159)
ECAT0_TXD2_GPIO160: U1.B9(GPIO160)
ECAT0_TXD3_GPIO161: U1.C9(GPIO161)
ECAT0_TXEN_GPIO156: U1.D12(GPIO156)
ECAT1_INT_GPIO128: U1.W9(GPIO128)
ECAT1_LINK_GPIO144: U1.F17(GPIO144)
ECAT1_PHYLINK_GPIO68: U1.C18(GPIO68)
ECAT1_RXCLK_GPIO137: U1.T18(GPIO137)
ECAT1_RXD0_GPIO139: U1.N19(GPIO139)
ECAT1_RXD1_GPIO140: U1.M19(GPIO140)
ECAT1_RXD2_GPIO141: U1.M18(GPIO141)
ECAT1_RXD3_GPIO142: U1.L19(GPIO142)
ECAT1_RXDV_GPIO136: U1.T17(GPIO136)
ECAT1_RXER_GPIO138: U1.T19(GPIO138)
ECAT1_TXCLK_GPIO130: U1.U10(GPIO130)
ECAT1_TXD0_GPIO131: U1.V10(GPIO131)
ECAT1_TXD1_GPIO132: U1.W18(GPIO132)
ECAT1_TXD2_GPIO134: U1.V18(GPIO134)
ECAT1_TXD3_GPIO135: U1.U18(GPIO135)
ECAT1_TXEN_GPIO129: U1.T10(GPIO129)
ECAT_EEPROM_SCL_GPIO151: U1.C13(GPIO151)
ECAT_EEPROM_SDA_GPIO150: U1.B13(GPIO150)
ECAT_ERROR_GPIO145: U1.E17(GPIO145)
ECAT_MDC_GPIO152: U1.D13(GPIO152)
ECAT_MDIO_GPIO153: U1.A12(GPIO153)
ECAT_nRST_GPIO155: U1.C12(GPIO155)
ECAT_RUN_GPIO146: U1.D18(GPIO146)
ENC1_BISS_CLK_GPIO12: U1.C2(GPIO12)
ENC1_PWEN_GPIO66: U1.K17(GPIO66)
ENC1_SIMO_GPIO63: U1.J16(GPIO63)
ENC1_SOMI_GPIO64: R69.2
Enc1_SPI_SCLK_Gen_GPIO13: U1.D1(GPIO13) U1.K16(GPIO65)  [also labelled Enc1_SPI_SCLK_GPIO65]
ENC2_BISS_CLK_GPIO14: U1.D2(GPIO14)
ENC2_PWEN_GPIO94: U1.A3(GPIO94)
ENC2_SIMO_GPIO91: U1.B5(GPIO91)
ENC2_SOMI_GPIO92: R65.1
Enc2_SPI_SCLK_Gen_GPIO15: U1.B4(GPIO93) U1.D3(GPIO15)  [also labelled Enc2_SPI_SCLK_GPIO93]
ENC3_CLK_GPIO56: U1.N16(GPIO56)
ENC3_CS_GPIO57: U1.N18(GPIO57)
ENC3_SIMO_GPIO54: U1.P18(GPIO54)
ENC3_SOMI_GPIO55: R67.2
ENC4_CLK_GPIO60: U1.M17(GPIO60)
ENC4_CS_GPIO61: U1.L16(GPIO61)
ENC4_SIMO_GPIO58: U1.N17(GPIO58)
ENC4_SOMI_GPIO59: R68.2
EQEP1A_GPIO20: U1.F2(GPIO20)
EQEP1B_GPIO21: U1.F3(GPIO21)
EQEP1I_GPIO23: U1.K4(GPIO23)
EQEP2A_GPIO24: U1.K3(GPIO24)
EQEP2B_GPIO25: U1.K2(GPIO25)
EQEP2I_GPIO26: U1.K1(GPIO26)
EXT_CLK_GPIO52: U1.P16(GPIO52)
EXT_CS_GPIO103: U1.J1(GPIO103)
EXT_SIMO_GPIO50: U1.R18(GPIO50)
EXT_SOMI_GPIO51: U1.R19(GPIO51)
FS1_I2CA_SCL_GPIO32: U1.U13(GPIO32)
FS1_I2CA_SDA_GPIO31: U1.U11(GPIO31)
FS2_I2CB_SCL_GPIO41: U1.U17(GPIO41)
FS2_I2CB_SDA_GPIO40: U1.V17(GPIO40)
MCAN_RX_GPIO70: U1.A17(GPIO70)
MCAN_TX_GPIO71: U1.B17(GPIO71)
RGB_B_GPIO116: U1.W10(GPIO116)
RGB_G_GPIO29: U1.W11(GPIO29)
RGB_R_GPIO28: U1.V11(GPIO28)
STO1_3V_GPIO121: U1.W16(GPIO121)
STO1_OUT_GPIO39: U1.W17(GPIO39)
TEMP_CHAIN_RX_GPIO85: U1.B11(GPIO85)
TEMP_CHAIN_TX_GPIO84: U1.A11(GPIO84)
USB0_DM_GPIO42: U1.D19(GPIO42)
USB0_DP_GPIO43: U1.C19(GPIO43)
NetR65_2: R65.2 U1.A4(GPIO92)
NetR66_1: R66.1 U1.E2(GPIO17)
NetR67_1: R67.1 U1.P19(GPIO55)
NetR68_1: R68.1 U1.M16(GPIO59)
NetR69_1: R69.1 U1.L17(GPIO64)

Not connected (* = marked no-connect by the designer): U1 A2(GPIO97) A13(GPIO149) A14(GPIO81) A15(GPIO77) B3(GPIO95) B14(GPIO82) B15(GPIO78) B18(GPIO69) B19(GPIO67) C3(GPIO96) C6(GPIO88) C11(GPIO86) C14(GPIO83) C15(GPIO79) C16(GPIO76) C17(GPIO74) D11(GPIO87) D15(GPIO80) D16(GPIO75) D17(GPIO147) E18(GPIO47) E19(GPIO46) F1(GPIO98) G1(GPIO99) G18(GPIO133) H1(GPIO100) H2(GPIO101) H3(GPIO102) J4(GPIO22) J17(GPIO62) K18(GPIO44) K19(GPIO45) L1(GPIO27) L2(GPIO106) L3(GPIO107) L4(GPIO108) M2(GPIO110) M3(GPIO112) M4(GPIO111) N2(GPIO109) N3(GPIO114) N4(GPIO113) P17(GPIO53) R16(GPIO48) R17(GPIO49) T8(GPIO122) T9(GPIO125) T11(GPIO30) T12(GPIO118) T13(GPIO33) T15(GPIO119) T16(GPIO38) U8(GPIO123) U9(GPIO126) U12(GPIO117) U14(GPIO34) U15(GPIO120) V8(GPIO124) V9(GPIO127) V12(GPIO115)

### Notes on the sheet
- Sve 20,21,23,24,25,26 for cuadrature
- Title:
- Date:
- Project:
- Author:
- Rev:
- Size:
- A3
- File:
- Sheet
- of
- Labels drawn without touching a wire or pin: EXT_GPIO95, EXT_GPIO96, EXT_GPIO97, EXT_GPIO98, MCU_GPIO22, MCU_GPIO27, MCU_GPIO30, MCU_GPIO33, MCU_GPIO34, MCU_GPIO38, MCU_GPIO44, MCU_GPIO45, MCU_GPIO46, MCU_GPIO47, MCU_GPIO48, MCU_GPIO49, MCU_GPIO53, MCU_GPIO62, MCU_GPIO67, MCU_GPIO69, MCU_GPIO74, MCU_GPIO75, MCU_GPIO76, MCU_GPIO77, MCU_GPIO78, MCU_GPIO79, MCU_GPIO80, MCU_GPIO81, MCU_GPIO82, MCU_GPIO83, MCU_GPIO84, MCU_GPIO85, MCU_GPIO86, MCU_GPIO87, MCU_GPIO88, MCU_GPIO99, MCU_GPIO100, MCU_GPIO101, MCU_GPIO102, MCU_GPIO106, MCU_GPIO107, MCU_GPIO108, MCU_GPIO109, MCU_GPIO110, MCU_GPIO111, MCU_GPIO112, MCU_GPIO113, MCU_GPIO114, MCU_GPIO115, MCU_GPIO117, MCU_GPIO118, MCU_GPIO119, MCU_GPIO120, MCU_GPIO122, MCU_GPIO123, MCU_GPIO124, MCU_GPIO125, MCU_GPIO126, MCU_GPIO127, MCU_GPIO133, MCU_GPIO147, MCU_GPIO149, RGB_B_GPIO116, STO1_3V_GPIO39

### Library data of the parts
R65-R69 = 22R/50V 1% 0402 63mW: as R2 on sheet MC21R01_uC_Support; Supplier 1: Farnell; Supplier Part Number 1: 1469697; Value: 22R
U1 = TMS320F28388: as U1 on sheet MC21R01_uC_Power; ComponentLink1Description: Datasheet Link; ComponentLink2Description: Product Folder; PackageReference: ZWT0337A; PackageDescription: NFBGA-337; ComponentLink2URL: http://www.ti.com/product/tms320f28388d; Alternate Manufacturer: Texas Instruments; ComponentLink3URL: http://www.ti.com/product/tms320f28388d/datasheet; ComponentLink1URL: http://www.ti.com/lit/ds/symlink/tms320f28388d.pdf; MountType: SMT; ComponentLink3Description: Online Datasheet; SizeX_mm: 16; PartNumber: TMS320F28388DZWTS

## Sheet MC21R01_Inverter_1.SchDoc: MC21R01 Top Level
size A3; Author: AMP; DrawnBy: AMP; Organization: Altium Limited; Address1: 3 Minna Close; Address2: Belrose; Address3: NSW 2085; Address4: Australia; DocumentNumber: 0; Revision: 1.0; SheetNumber: 0; SheetTotal: 0
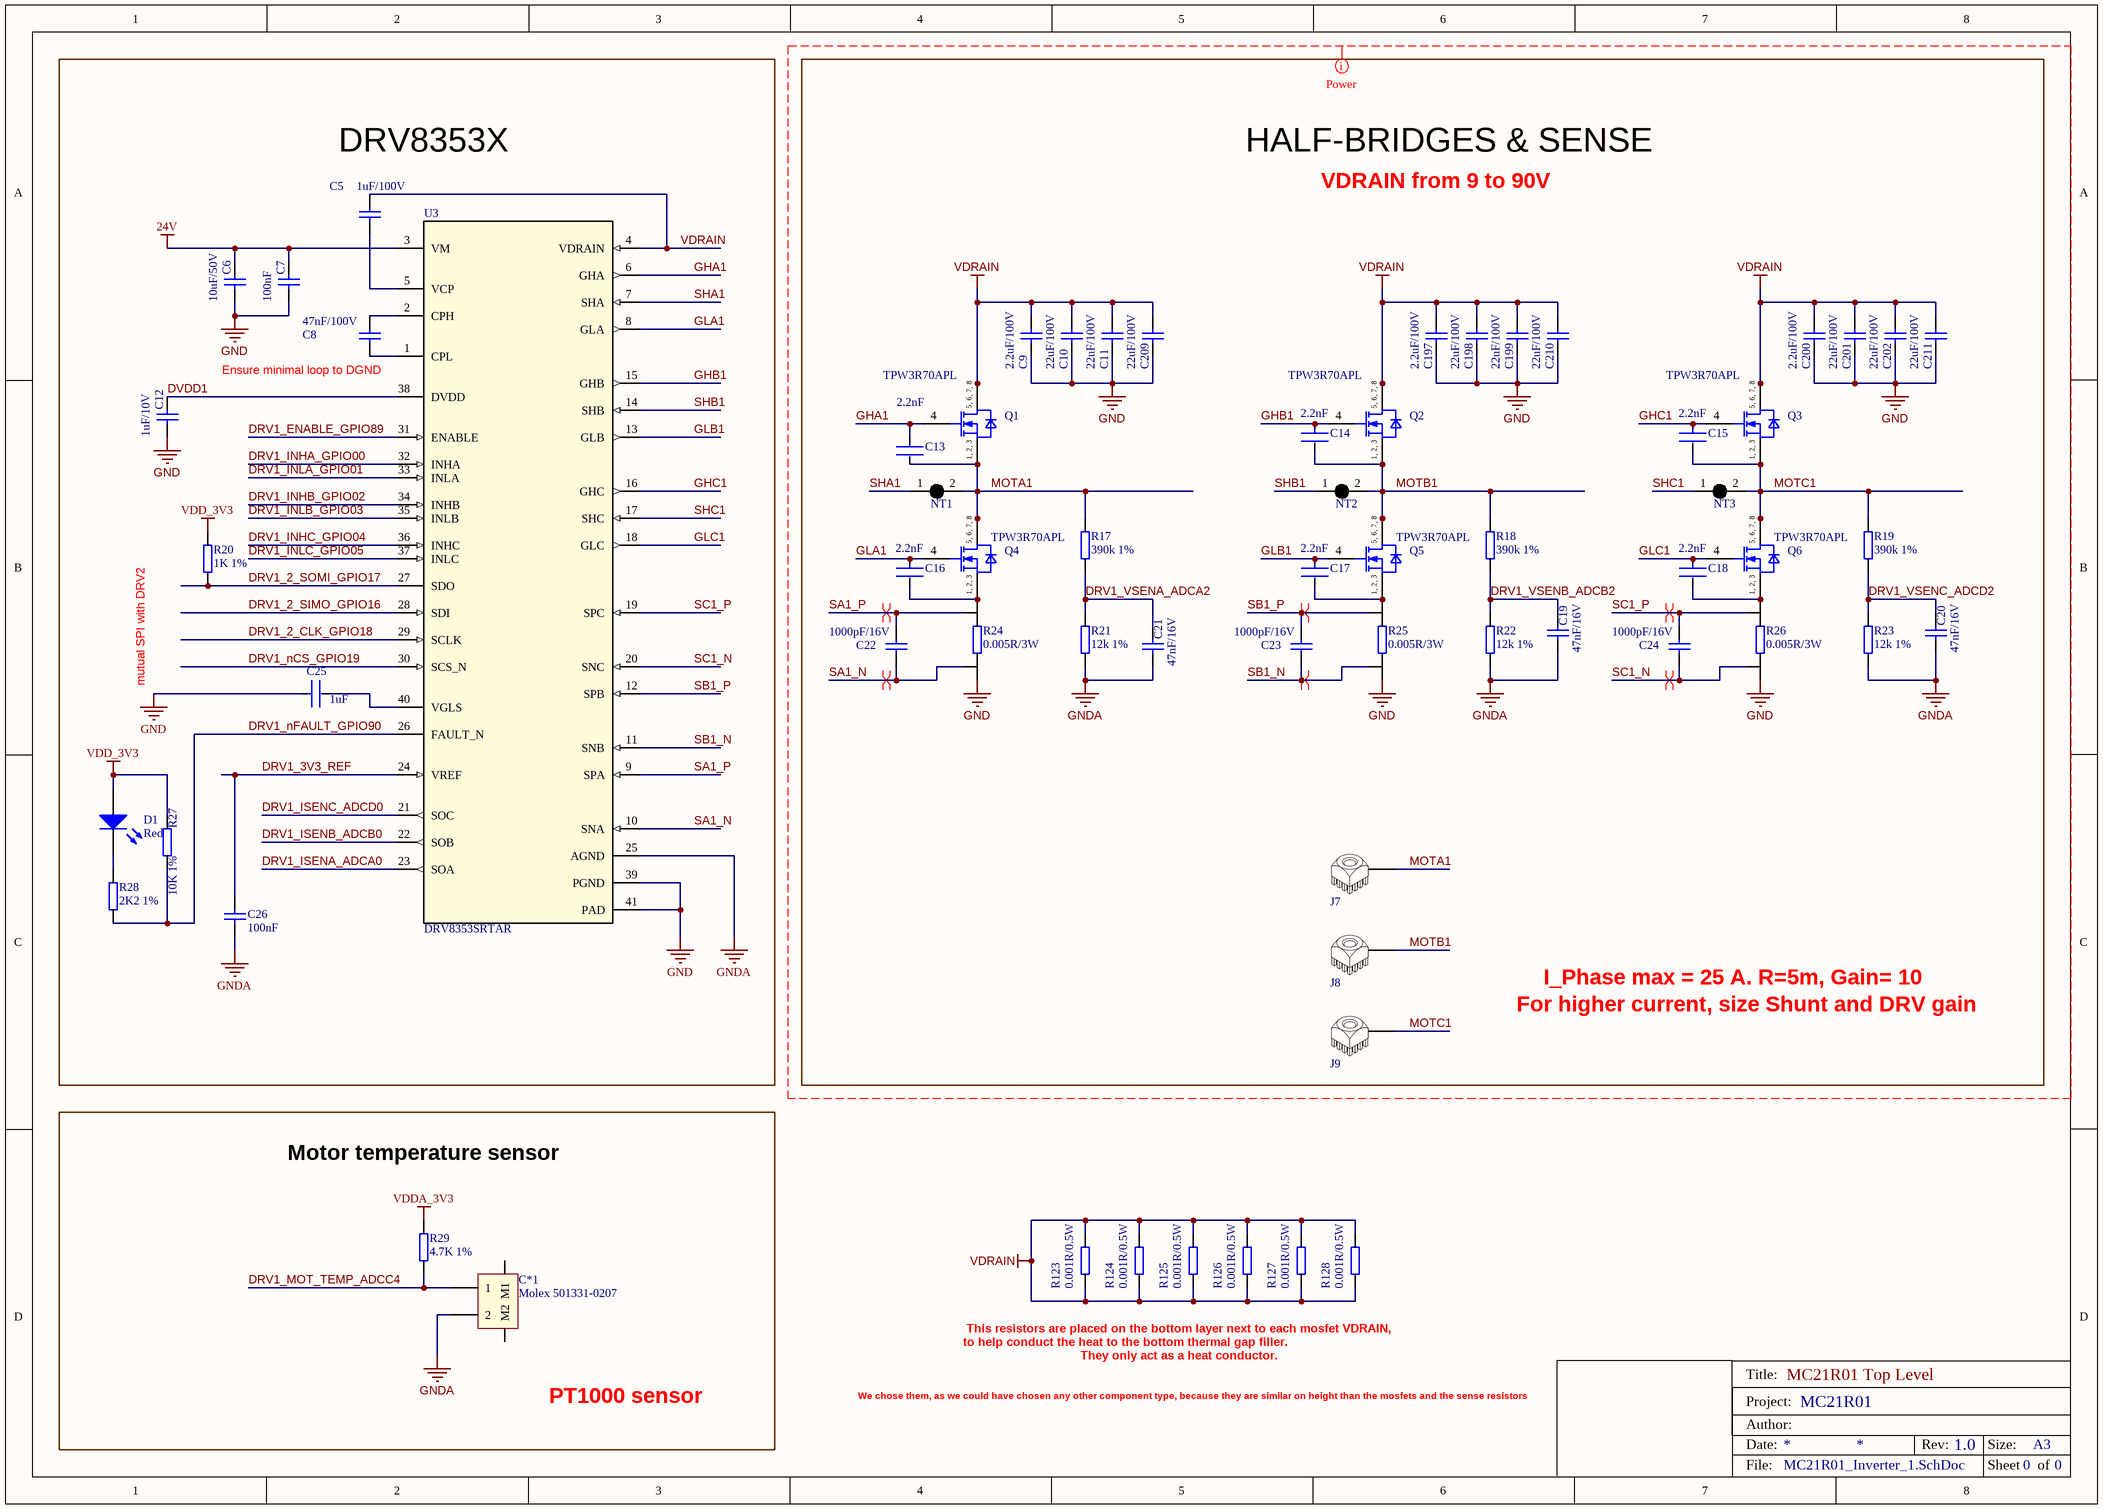
[diagram p4: MC21R01_Inverter_1.SchDoc]

### Parts
C5  value 1uF/100V  [0805 SMD capacitor]  (hidden comment: 1uF/100V 0805 10% X7R)
C6  value 10uF/50V  [1206 SMD Capacitor]  (hidden comment: 10uf/50V 1206 20% X5R)
C7  value 100nF  [CAPC0603X03N]  (hidden comment: 100nF/25V 0201 10% X6S)
C8  value 47nF/100V  [0603 SMD capacitor]  (hidden comment: 47nF/100V 0603 10% X7R)
C9  value 2.2uF/100V  [1210 SMD capacitor h=2mm]  (hidden comment: 2.2uF/100V 1210 10% X7R)
C10  value 22uF/100V  [2220 SMD Capacitor H=5MM]  (hidden comment: 22uF/100V 2220 20% X7S)
C11  value 22uF/100V  [2220 SMD Capacitor H=5MM]  (hidden comment: 22uF/100V 2220 20% X7S)
C12  value 1uF/10V  [0603 SMD capacitor]  (hidden comment: 1uF/10V 0603 10% X7R)
C13  Capacitance: 2.2nF  [FP-GRM033-0_03-IPC_A]  (hidden comment: 2200pF/50V 0201 10% X7R)
C14  Capacitance: 2.2nF  [FP-GRM033-0_03-IPC_A]  (hidden comment: 2200pF/50V 0201 10% X7R)
C15  Capacitance: 2.2nF  [FP-GRM033-0_03-IPC_A]  (hidden comment: 2200pF/50V 0201 10% X7R)
C16  Capacitance: 2.2nF  [FP-GRM033-0_03-IPC_A]  (hidden comment: 2200pF/50V 0201 10% X7R)
C17  Capacitance: 2.2nF  [FP-GRM033-0_03-IPC_A]  (hidden comment: 2200pF/50V 0201 10% X7R)
C18  Capacitance: 2.2nF  [FP-GRM033-0_03-IPC_A]  (hidden comment: 2200pF/50V 0201 10% X7R)
C19  value 47nF/16V  [0402 SMD Capacitor]  (hidden comment: 47nF/16V 0402 10% X7R)
C20  value 47nF/16V  [0402 SMD Capacitor]  (hidden comment: 47nF/16V 0402 10% X7R)
C21  value 47nF/16V  [0402 SMD Capacitor]  (hidden comment: 47nF/16V 0402 10% X7R)
C22  value 1000pF/16V  [0402 SMD Capacitor]  (hidden comment: 1000pF/16V 0402 10% X7R)
C23  value 1000pF/16V  [0402 SMD Capacitor]  (hidden comment: 1000pF/16V 0402 10% X7R)
C24  value 1000pF/16V  [0402 SMD Capacitor]  (hidden comment: 1000pF/16V 0402 10% X7R)
C25  Capacitance: 1uF  [FP-CL03-IPC_A]  (hidden comment: 1uF/6.3V 0201 10% X5R)
C26  value 100nF  [CAPC0603X03N]  (hidden comment: 100nF/25V 0201 10% X6S)
C197  value 2.2uF/100V  [1210 SMD capacitor h=2mm]  (hidden comment: 2.2uF/100V 1210 10% X7R)
C198  value 22uF/100V  [2220 SMD Capacitor H=5MM]  (hidden comment: 22uF/100V 2220 20% X7S)
C199  value 22uF/100V  [2220 SMD Capacitor H=5MM]  (hidden comment: 22uF/100V 2220 20% X7S)
C200  value 2.2uF/100V  [1210 SMD capacitor h=2mm]  (hidden comment: 2.2uF/100V 1210 10% X7R)
C201  value 22uF/100V  [2220 SMD Capacitor H=5MM]  (hidden comment: 22uF/100V 2220 20% X7S)
C202  value 22uF/100V  [2220 SMD Capacitor H=5MM]  (hidden comment: 22uF/100V 2220 20% X7S)
C209  value 22uF/100V  [2220 SMD Capacitor H=5MM]  (hidden comment: 22uF/100V 2220 20% X7S)
C210  value 22uF/100V  [2220 SMD Capacitor H=5MM]  (hidden comment: 22uF/100V 2220 20% X7S)
C211  value 22uF/100V  [2220 SMD Capacitor H=5MM]  (hidden comment: 22uF/100V 2220 20% X7S)
C*1  Molex 501331-0207  [Molex 501331-0207]
D1  Red  [0402 SMD LED Red]
J7  WE_7461094  [WE_7461094]  (value not drawn)
J8  WE_7461094  [WE_7461094]  (value not drawn)
J9  WE_7461094  [WE_7461094]  (value not drawn)
NT1  Net Tie SMD  [Net Tie SMD 0.4x0.8mm]  (value not drawn)  (net tie, no BOM)
NT2  Net Tie SMD  [Net Tie SMD 0.4x0.8mm]  (value not drawn)  (net tie, no BOM)
NT3  Net Tie SMD  [Net Tie SMD 0.4x0.8mm]  (value not drawn)  (net tie, no BOM)
Q1  TPW3R70APL  [DSOP Advance Toshiba]
Q2  TPW3R70APL  [DSOP Advance Toshiba]
Q3  TPW3R70APL  [DSOP Advance Toshiba]
Q4  TPW3R70APL  [DSOP Advance Toshiba]
Q5  TPW3R70APL  [DSOP Advance Toshiba]
Q6  TPW3R70APL  [DSOP Advance Toshiba]
R17  390k 1%  [0603 SMD resistor]
R18  390k 1%  [0603 SMD resistor]
R19  390k 1%  [0603 SMD resistor]
R20  1K 1%  [0402 SMD rESISTOR]
R21  12k 1%  [0603 SMD resistor]
R22  12k 1%  [0603 SMD resistor]
R23  12k 1%  [0603 SMD resistor]
R24  0.005R/3W  [2512 SMD Resistor V2 NETTIE]
R25  0.005R/3W  [2512 SMD Resistor V2 NETTIE]
R26  0.005R/3W  [2512 SMD Resistor V2 NETTIE]
R27  10K 1%  [0402 SMD rESISTOR]
R28  2K2 1%  [0402 SMD rESISTOR]
R29  4.7K 1%  [0402 SMD rESISTOR]
R123  0.001R/0.5W  [2010 SMD Resistor VERTICAL]
R124  0.001R/0.5W  [2010 SMD Resistor VERTICAL]
R125  0.001R/0.5W  [2010 SMD Resistor VERTICAL]
R126  0.001R/0.5W  [2010 SMD Resistor VERTICAL]
R127  0.001R/0.5W  [2010 SMD Resistor VERTICAL]
R128  0.001R/0.5W  [2010 SMD Resistor VERTICAL]
U3  DRV8353SRTAR  [QFN50P600X600X80_HS-41N]

### Blocks framed on the sheet
DRV8353X: C5-C8 C12 C25 C26 D1 R20 R27 R28 U3
HALF-BRIDGES & SENSE: C9-C11 C13-C24 C197-C202 C209-C211 J7-J9 NT1-NT3 Q1-Q6 R17-R19 R21-R26

### Nets
24V: C6.1 C7.2 U3.3(VM)
GND: C6.2 C7.1 C9.2 C10.2 C11.2 C12.2 C25.1 C197.2 C198.2 C199.2 C200.2 C201.2 C202.2 C209.2 C210.2 C211.2 R24.1 R25.1 R26.1 U3.39(PGND) U3.41(PAD)
GNDA: C19.2 C20.2 C21.2 C26.1 C*1.2 R21.1 R22.1 R23.1 U3.25(AGND)
VDD_3V3: D1.A R20.2 R27.2
VDDA_3V3: R29.2
VDRAIN: C5.1 C9.1 C10.1 C11.1 C197.1 C198.1 C199.1 C200.1 C201.1 C202.1 C209.1 C210.1 C211.1 Q1.5(DRAIN) Q1.6(DRAIN) Q1.7(DRAIN) Q1.8(DRAIN) Q2.5(DRAIN) Q2.6(DRAIN) Q2.7(DRAIN) Q2.8(DRAIN) Q3.5(DRAIN) Q3.6(DRAIN) Q3.7(DRAIN) Q3.8(DRAIN) R123.1 R123.2 R124.1 R124.2 R125.1 R125.2 R126.1 R126.2 R127.1 R127.2 R128.1 R128.2 U3.4(VDRAIN)
DRV1_2_CLK_GPIO18: U3.29(SCLK)
DRV1_2_SIMO_GPIO16: U3.28(SDI)
DRV1_2_SOMI_GPIO17: R20.1 U3.27(SDO)
DRV1_3V3_REF: C26.2 U3.24(VREF)
DRV1_ENABLE_GPIO89: U3.31(ENABLE)
DRV1_INHA_GPIO00: U3.32(INHA)
DRV1_INHB_GPIO02: U3.34(INHB)
DRV1_INHC_GPIO04: U3.36(INHC)
DRV1_INLA_GPIO01: U3.33(INLA)
DRV1_INLB_GPIO03: U3.35(INLB)
DRV1_INLC_GPIO05: U3.37(INLC)
DRV1_ISENA_ADCA0: U3.23(SOA)
DRV1_ISENB_ADCB0: U3.22(SOB)
DRV1_ISENC_ADCD0: U3.21(SOC)
DRV1_MOT_TEMP_ADCC4: C*1.1 R29.1
DRV1_nCS_GPIO19: U3.30(SCS_N)
DRV1_nFAULT_GPIO90: R27.1 R28.1 U3.26(FAULT_N)
DRV1_VSENA_ADCA2: C21.1 R17.1 R21.2
DRV1_VSENB_ADCB2: C19.1 R18.1 R22.2
DRV1_VSENC_ADCD2: C20.1 R19.1 R23.2
DVDD1: C12.1 U3.38(DVDD)
GHA1: C13.1 Q1.4(GATE) U3.6(GHA)
GHB1: C14.1 Q2.4(GATE) U3.15(GHB)
GHC1: C15.1 Q3.4(GATE) U3.16(GHC)
GLA1: C16.1 Q4.4(GATE) U3.8(GLA)
GLB1: C17.1 Q5.4(GATE) U3.13(GLB)
GLC1: C18.1 Q6.4(GATE) U3.18(GLC)
MOTA1: C13.2 J7.1 NT1.2 Q1.1(SOURCE) Q1.2(SOURCE) Q1.3(SOURCE) Q4.5(DRAIN) Q4.6(DRAIN) Q4.7(DRAIN) Q4.8(DRAIN) R17.2
MOTB1: C14.2 J8.1 NT2.2 Q2.1(SOURCE) Q2.2(SOURCE) Q2.3(SOURCE) Q5.5(DRAIN) Q5.6(DRAIN) Q5.7(DRAIN) Q5.8(DRAIN) R18.2
MOTC1: C15.2 J9.1 NT3.2 Q3.1(SOURCE) Q3.2(SOURCE) Q3.3(SOURCE) Q6.5(DRAIN) Q6.6(DRAIN) Q6.7(DRAIN) Q6.8(DRAIN) R19.2
SA1_N: C22.2 R24.3 U3.10(SNA)
SA1_P: C22.1 R24.4 U3.9(SPA)
SB1_N: C23.2 R25.3 U3.11(SNB)
SB1_P: C23.1 R25.4 U3.12(SPB)
SC1_N: C24.2 R26.3 U3.20(SNC)
SC1_P: C24.1 R26.4 U3.19(SPC)
SHA1: NT1.1 U3.7(SHA)
SHB1: NT2.1 U3.14(SHB)
SHC1: NT3.1 U3.17(SHC)
NetC5_2: C5.2 U3.5(VCP)
NetC8_1: C8.1 U3.2(CPH)
NetC8_2: C8.2 U3.1(CPL)
NetC16_2: C16.2 Q4.1(SOURCE) Q4.2(SOURCE) Q4.3(SOURCE) R24.2
NetC17_2: C17.2 Q5.1(SOURCE) Q5.2(SOURCE) Q5.3(SOURCE) R25.2
NetC18_2: C18.2 Q6.1(SOURCE) Q6.2(SOURCE) Q6.3(SOURCE) R26.2
NetC25_2: C25.2 U3.40(VGLS)
NetD1_K: D1.K R28.2

Not connected (* = marked no-connect by the designer): C*1 M1 M2

### Layout directives
net class Power: DRV1_VSENA_ADCA2, DRV1_VSENB_ADCB2, DRV1_VSENC_ADCD2, GHA1, GHB1, GHC1, GLA1, GLB1, GLC1, GND, GNDA, MOTA1, MOTB1, MOTC1, SA1_N, SA1_P, SB1_N, SB1_P, SC1_N, SC1_P, SHA1, SHB1, SHC1, VDRAIN
differential pair; differential pair class ADC; differential pair class ADC: SA1_P
differential pair; differential pair class ADC: SA1_N, SB1_N, SB1_P, SC1_N, SC1_P

### Notes on the sheet
- VDRAIN from 9 to 90V
- (near C8) Ensure minimal loop to DGND
- mutual SPI with DRV2
- I_Phase max = 25 A. R=5m, Gain= 10
- For higher current, size Shunt and DRV gain
- Motor temperature sensor
- This resistors are placed on the bottom layer next to each mosfet VDRAIN,
- PT1000 sensor
- to help conduct the heat to the bottom thermal gap filler.
- They only act as a heat conductor.
- We chose them, as we could have chosen any other component type, because they are similar on height than the mosfets and the sense resistors
- Title:
- Date:
- Project:
- Author:
- Rev:
- Size:
- A3
- File:
- Sheet
- of
- (in symbol TPW3R70APL) 5, 6, 7, 8; 1, 2, 3

### Library data of the parts
C5 = 1uF/100V 0805 10% X7R: 1 uF 100 V 0805  ±10% Tolerance X7R Multilayer Ceramic Chip Capacitor; Manufacturer 1: AVX; Manufacturer Part Number 1: 08051C105K4T2A; Supplier 1: Farnell; Supplier 2: Mouser; Supplier Part Number 1: 2834935; Supplier Part Number 2: 581-08051C105K4T2A
C6 = 10uF/50V 1206 20% X5R: 10 uF 50 V 1206 ±20% Tolerance X5R Multilayer Ceramic Chip Capacitor; Manufacturer 1: Samsung; Manufacturer Part Number 1: CL31A106MBHNNNE; Supplier 1: Digi-key; Supplier Part Number 1: 1276-6736-1-ND
C7 C26 = CMP-001-00061-1: as C1 on sheet MC21R01_uC_Support; Capacitance: 100nF; Case/Package: 0201; Case Code (Imperial): 0201; Case Code (Metric): 0603; Dielectric: X6S; Height: 0.3mm; Length: 0.024inch; Max Operating Temperature: 105°C; Min Operating Temperature: -55°C; Mount: Surface Mount; Package Quantity: 15000; Packaging: Tape and Reel; Termination: SMD/SMT; Thickness: 0.013inch; Tolerance: 10%; Voltage Rating: 25V; Weight: 1.2E-05oz; Width: 0.3mm
C8 = 47nF/100V 0603 10% X7R_1: 47 nF 100 V 0603 ±10% Tolerance X7R Multilayer Ceramic Chip Capacitor; Manufacturer 1: KEMET; Manufacturer Part Number 1: C0603C473K1RACTU; Supplier 1: Farnell; Supplier Part Number 1: 1865550
C9 C197 C200 = 2.2uF/100V 1210 10% X7R: 2.2 uF 100 V 1210  ±10% Tolerance X7R Multilayer Ceramic Chip Capacitor; Manufacturer 1: KEMET; Manufacturer Part Number 1: C1210C225K1RACTU; Supplier 1: Farnell; Supplier Part Number 1: 1793832
C10 C11 C198 C199 C201 C202 C209-C211 = 22uF/100V 2220 20% X7S: 22 uF 100 V 2220 ±20% Tolerance X7S Multilayer Ceramic Chip Capacitor; Manufacturer 1: TDK; Manufacturer Part Number 1: CKG57NX7S2A226M500JH; Supplier 1: Farnell; Supplier Part Number 1: 2210742
C12 = 1uF/10V 0603 10% X7R: 1uF/10V 0603 10% Tolerance X7R Multilayer Ceramic Chip Capacitor; Manufacturer 1: TAIYO YUDEN; Manufacturer Part Number 1: LMK107B7105KA-T; Supplier Part Number 1: 2112849; Supplier 1: Farnell
C13-C18 = CMP-06035-000256-1: 2200pF/50V 0201 10% Tolerance X7R Multilayer Ceramic Chip Capacitor; Voltage Rating (DC): 25V; Depth: 0.3mm; Tolerance: 10%; Min Operating Temperature: -55°C; Max Operating Temperature: 125°C; Length: 0.6mm; Case Code (Metric): 0603; Width: 0.012inch; Height: 0.3mm; Case/Package: 0201; Mount: Surface Mount; Thickness: 0.013inch; Voltage Rating: 25V; Termination: SMD/SMT; Packaging: Tape and Reel; Package Quantity: 15000; Dielectric: X7R; Weight: 1.2E-05oz; Case Code (Imperial): 0201; Resistor Type: Ceramic
C19-C21 = 47nF/16V 0402 10% X7R: 47nF/16V 0402 10% Tolerance X7R Multilayer Ceramic Chip Capacitor; Manufacturer 1: Walsin; Manufacturer Part Number 1: 0402B473J160CT; Supplier 1: Farnell; Supplier Part Number 1: 2524710
C22-C24 = 1000pF/16V 0402 10% X7R_1: 1000pF/16V 0402 10% Tolerance X7R Multilayer Ceramic Chip Capacitor; Manufacturer 1: KEMET; Manufacturer Part Number 1: C0402C102K4RACTU; Supplier 1: Farnell; Supplier Part Number 1: 2522378
C25 = CMP-13271-003873-1: 1uF/6.3V 0201 10% Tolerance X5R Multilayer Ceramic Chip Capacitor; Voltage Rating: 6.3V; Tolerance: 20%; Lead Free: Lead Free; Packaging: Tape and Reel; Dielectric: X5R; Case Code (Imperial): 0201; Max Operating Temperature: 85°C; Case/Package: 0201; Depth: 0.3mm; Width: 0.012inch; Thickness: 0.013inch; Length: 0.024inch; Case Code (Metric): 0603; Package Quantity: 1; Min Operating Temperature: -55°C; Mount: Surface Mount
C*1 = Molex 501331-0207: PicoClasp 02 pin vertical; Supplier 1: Farnell; Supplier Part Number 1: 1835976
D1 = LED_0402_Red: Low Profile Chip LED, Red; Manufacturer: ROHM; Manufacturer Part Number: SML-P11UTT86R; Supplier 1: Farnell; Supplier Part Number 1: 2507545
J7-J9 = WE_7461094: REDCUBE PRESS-FIT with external thread and full plain pin-plate WPSHFU, 130A, M3 screw, 9pins; Manufacturer: WURTH ELEKTRONIK; Manufacturer Part Number: 7461094; Created by: Yaiza Montes; Published: 29/05/20; Value: WE_7461094; Supplier 1: Farnell; Supplier 2: Mouser; Supplier 3: Digi-Key; Supplier Part Number 1: 1821284; Supplier Part Number 2: 710-7461094; Supplier Part Number 3: 732-3212-ND
NT1-NT3 = Net Tie SMD: Net Tie starpoint
Q1-Q6 = TPW3R70APL: Silicon N-channel MOS (U-MOS-H); Manufacturer: Toshiba Semicon; Manufacturer Order Number: TPW3R70APL; PackageReference: DSOP Advance; Supplier 1: Mouser; Supplier 2: Mouser; Supplier Part Number 1: 757-TPW3R70APLL1Q; Supplier Part Number 2: 757-TPW3R70APLL1Q
R17-R19 = 390k/150V 1% 0603 250mW: 390k/150V 1% 0603 250mW SMD Resistor; Manufacturer 1: Panasonic; Manufacturer Part Number 1: ERJPA3F3903V; Supplier 1: Farnell; Supplier Part Number 1: 2335911
R20 = 1K/50V 1% 0402 100mW: 1K/50V 1% 0402 100mW SMD Resistor; Manufacturer 1: Yageo; Manufacturer Part Number 1: RC0402FR-071KL; Supplier 1: Mouser; Supplier 2: Farnell; Supplier Part Number 2: 9239235; Supplier Part Number 1: 603-RC0402FR-071KL; Value: 1K
R21-R23 = 12k/150V 1% 0603 250mW: 12k/150V 1% 0603 250mW SMD Resistor; Manufacturer 1: Panasonic; Manufacturer Part Number 1: ERJPA3F1202V; Supplier 1: Farnell; Supplier Part Number 1: 2335844
R24-R26 = 0.005R/3W 1% 2512 Shunt: 0.005R/3W 1% 2512 shunt SMD Resistor; Manufacturer 1: Bourns; Manufacturer Part Number 1: CRE2512-FZ-R005E-3; Supplier 1: Farnell; Supplier Part Number 1: 2434014
R27 = 10K/50V 1% 0402 100mW: as R16 on sheet MC21R01_uC_Support; Supplier 1: Farnell; Supplier Part Number 1: 9239359; Value: 10K
R28 = 2K2/50V 1% 0402 100mW: as R1 on sheet MC21R01_uC_Support; Supplier 1: Farnell; Supplier Part Number 1: 9239278
R29 = 4.7K/50V 1% 0402 100mW: as R9 on sheet MC21R01_uC_Support; Supplier 1: Farnell; Supplier Part Number 1: 1469712; Value: 4.7K
R123-R128 = 0.001R/0.5W 1% 2010 Shunt: 0.001R/0.5W 1% 2010 shunt SMD Resistor; Manufacturer 1: Vishay; Manufacturer Part Number 1: WSL20101L000FEA; Supplier 1: Farnell; Supplier Part Number 1: 2678801RL
U3 = DRV8353SRTAR: 102-V max 3-phase smart gate driver with current shunt amplifiers; Manufacturer: Texas Instruments; PartNumber: DRV8353SRTAR; RefDes: RefDes; TYPE: TYPE; Value: Value; Supplier 1: Arrow; Manufacturer Part Number: DRV8353SRTAR; RoHS: No; Stock 1: 2000; Pricing 1: 2000=3,20540, 4000=3,09430, 10000=3,08440, 50000=3,06460 (USD); Supplier Part Number 1: DRV8353SRTAR